# EAGLE schematic obc (EAGLE 9.4.2)

## Sheet 1 of 6: MCU
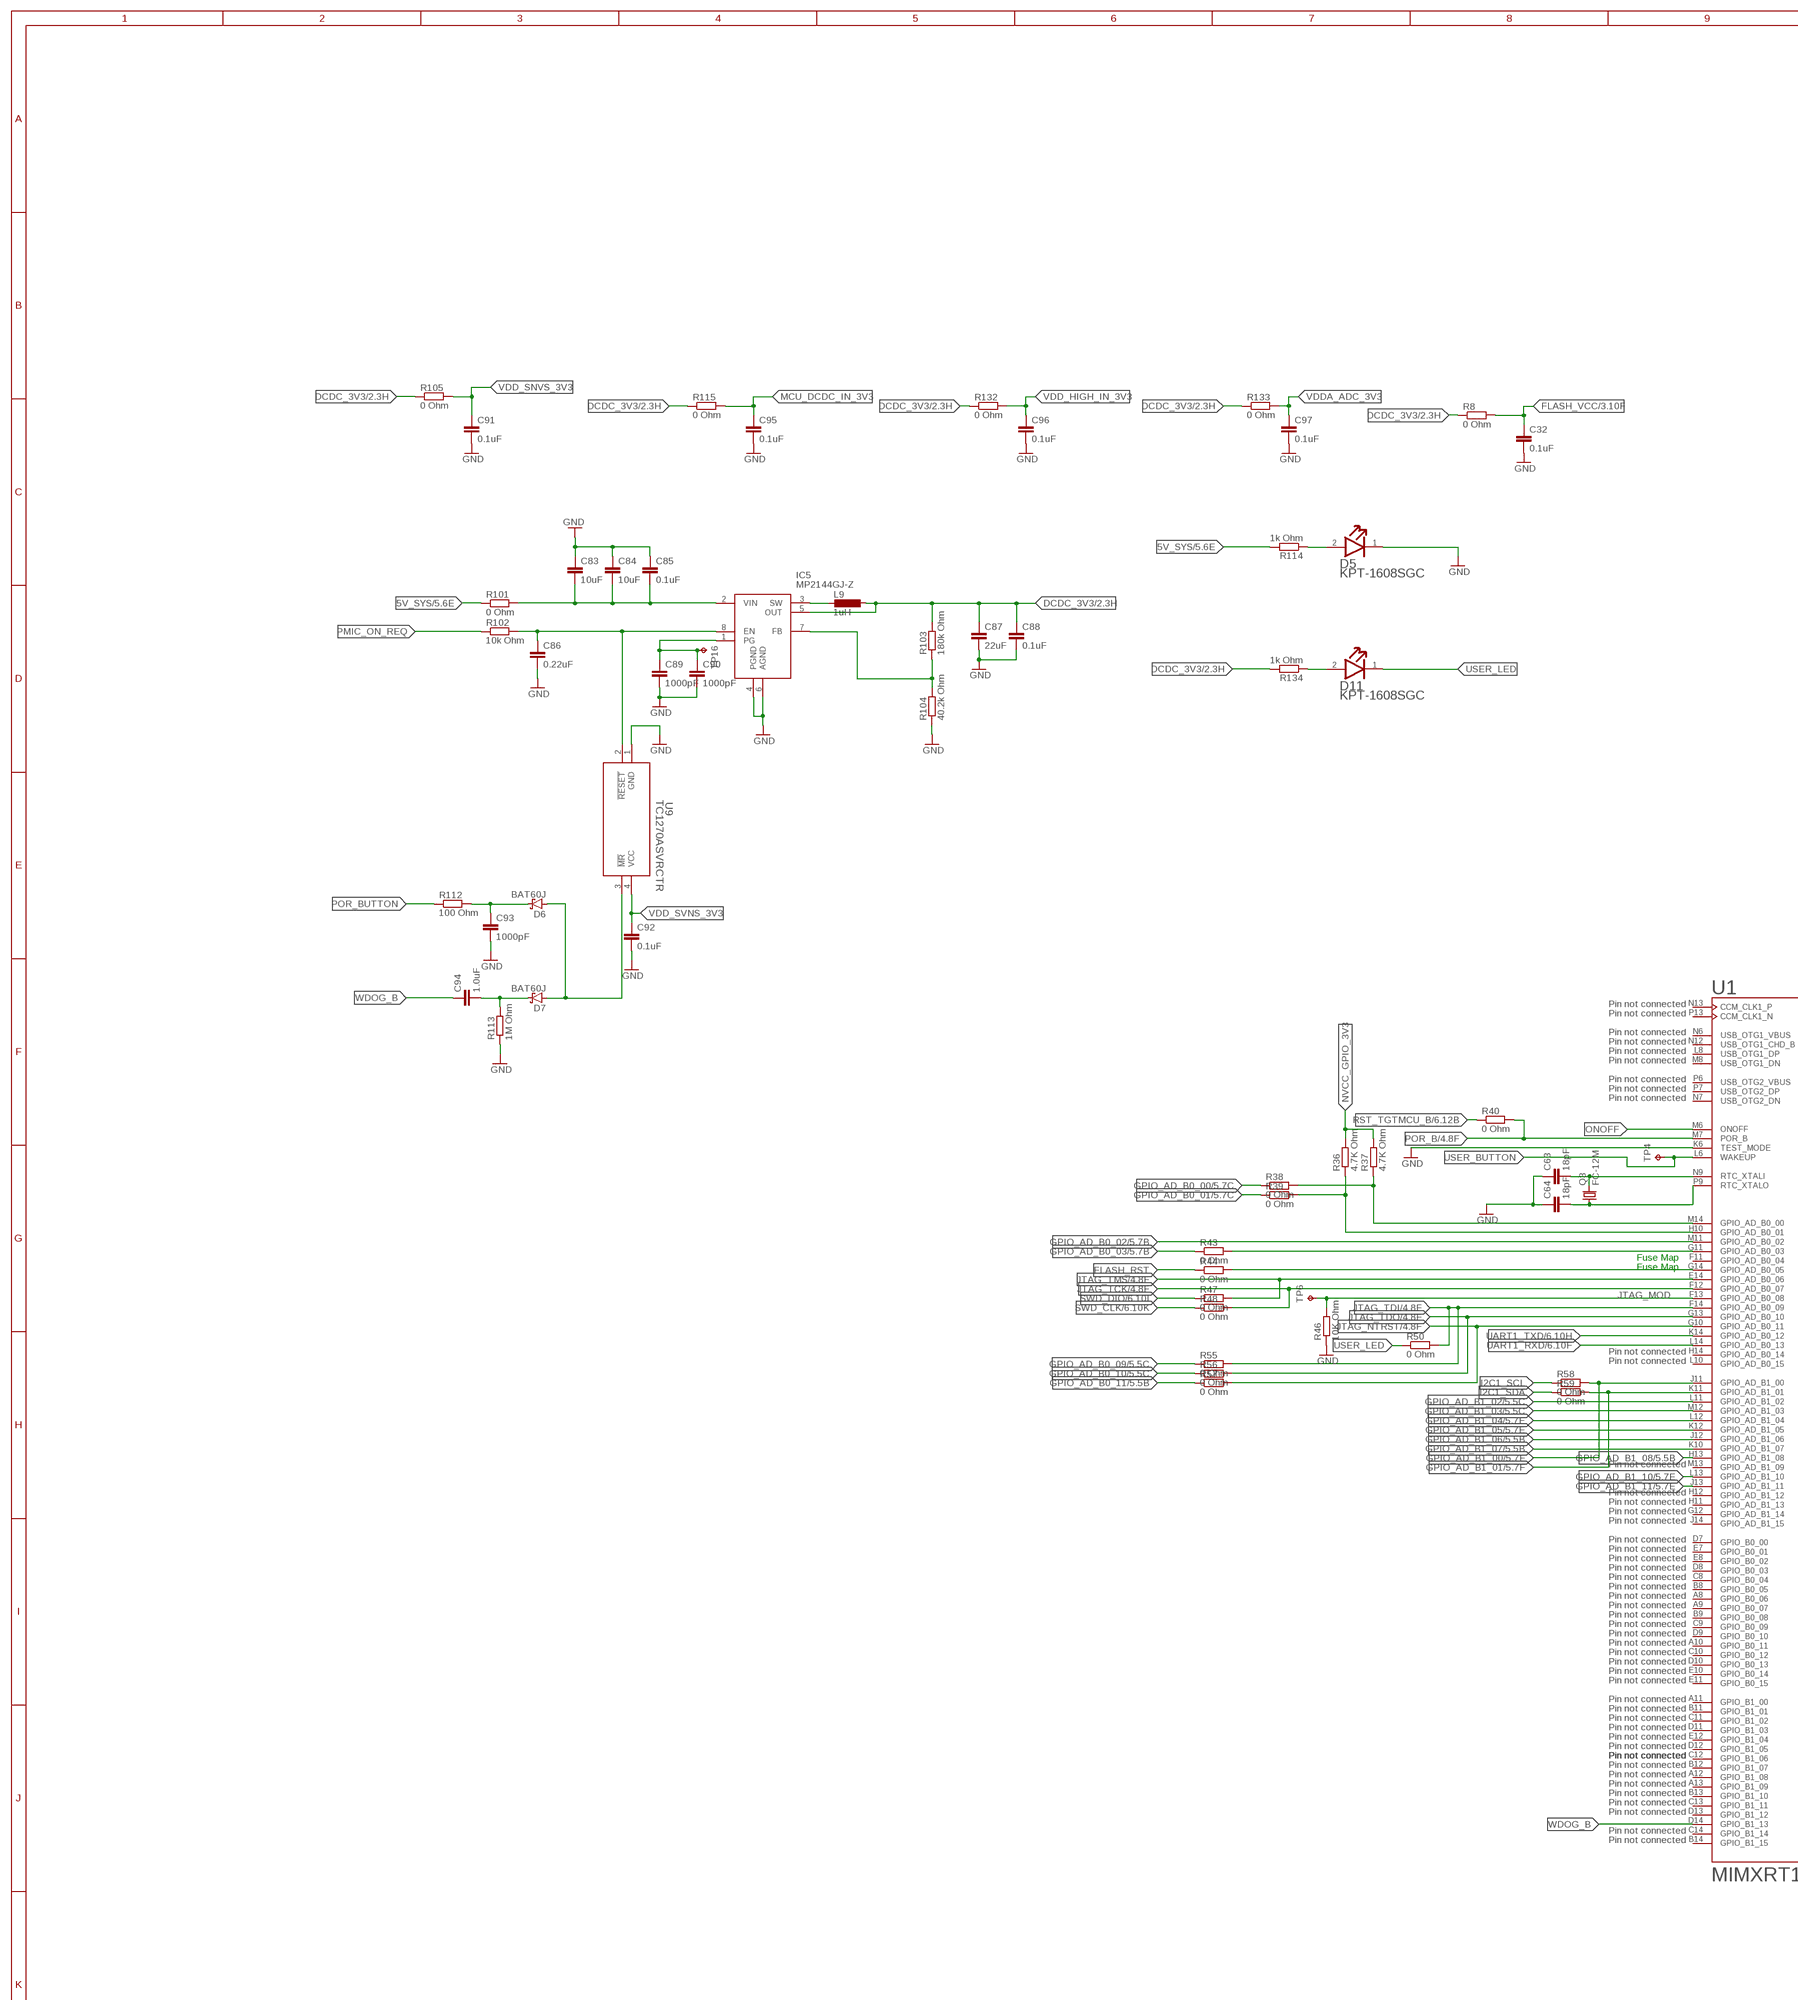
[diagram p0: schematic, sheet 1, part 1 of 3]
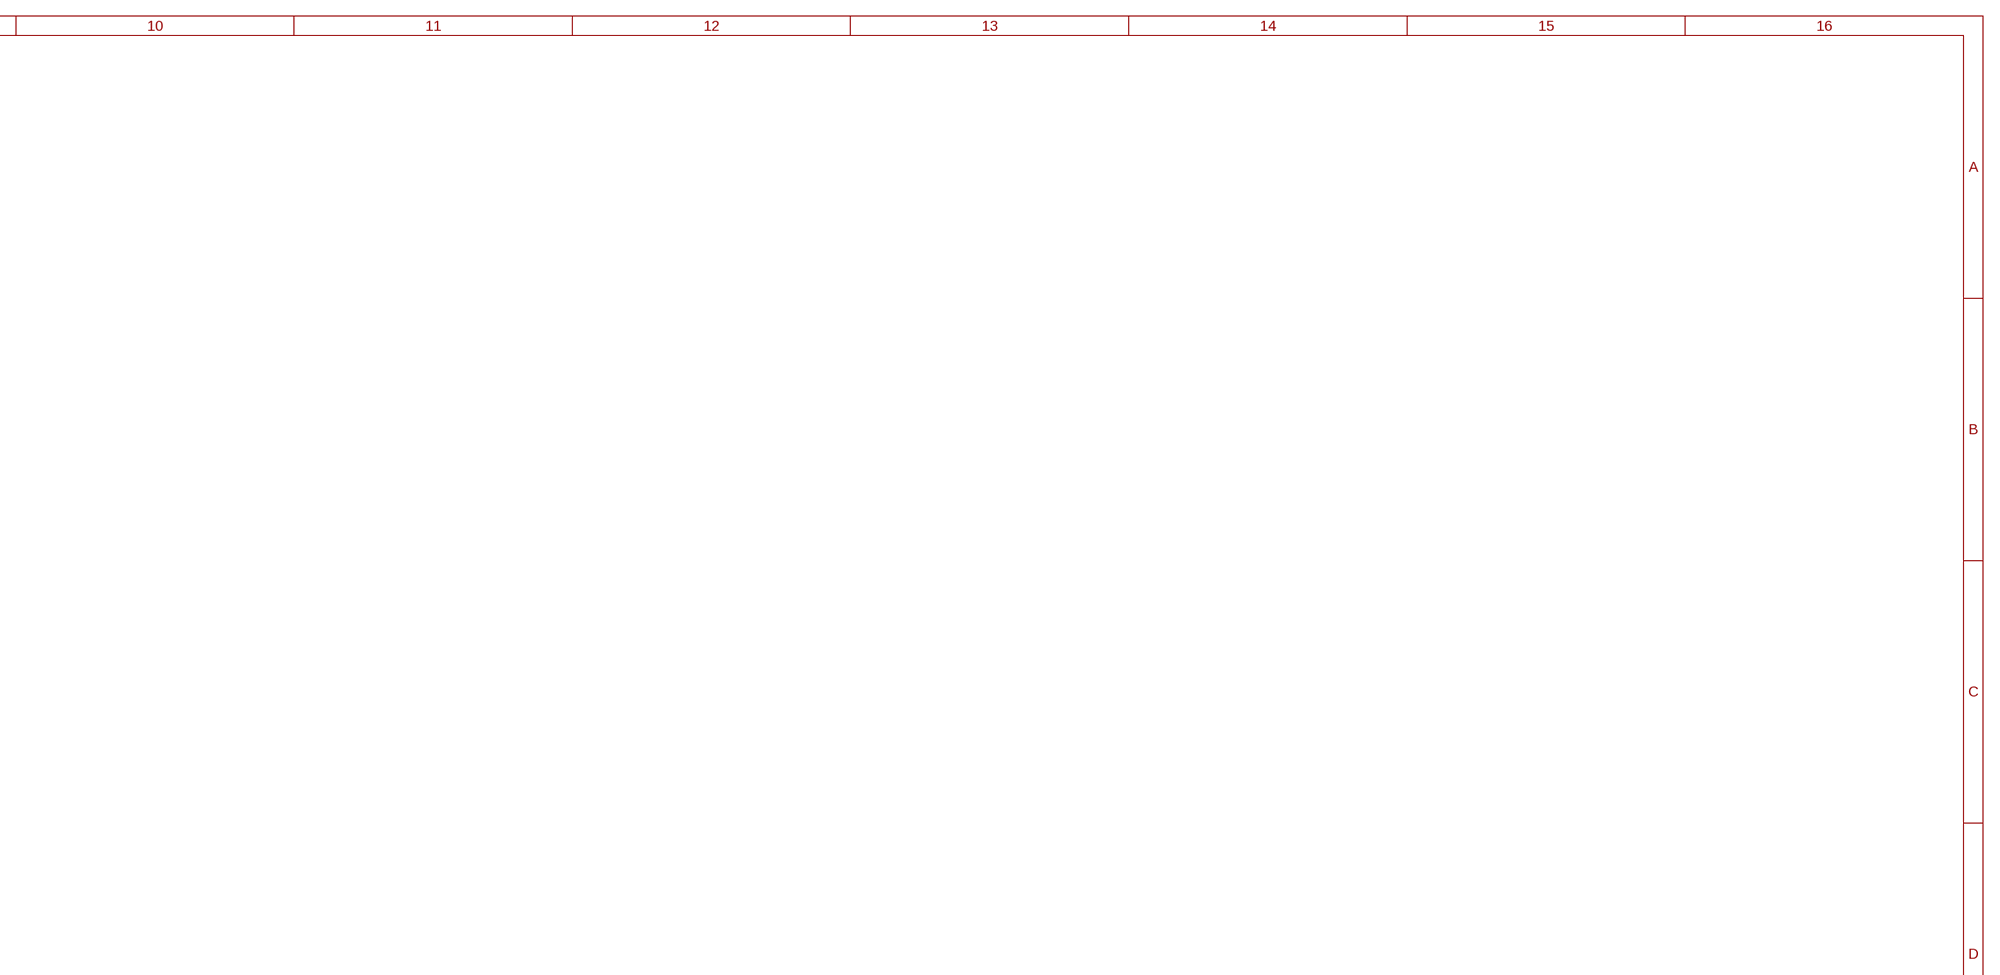
[diagram p1: schematic, sheet 1, part 2 of 3]
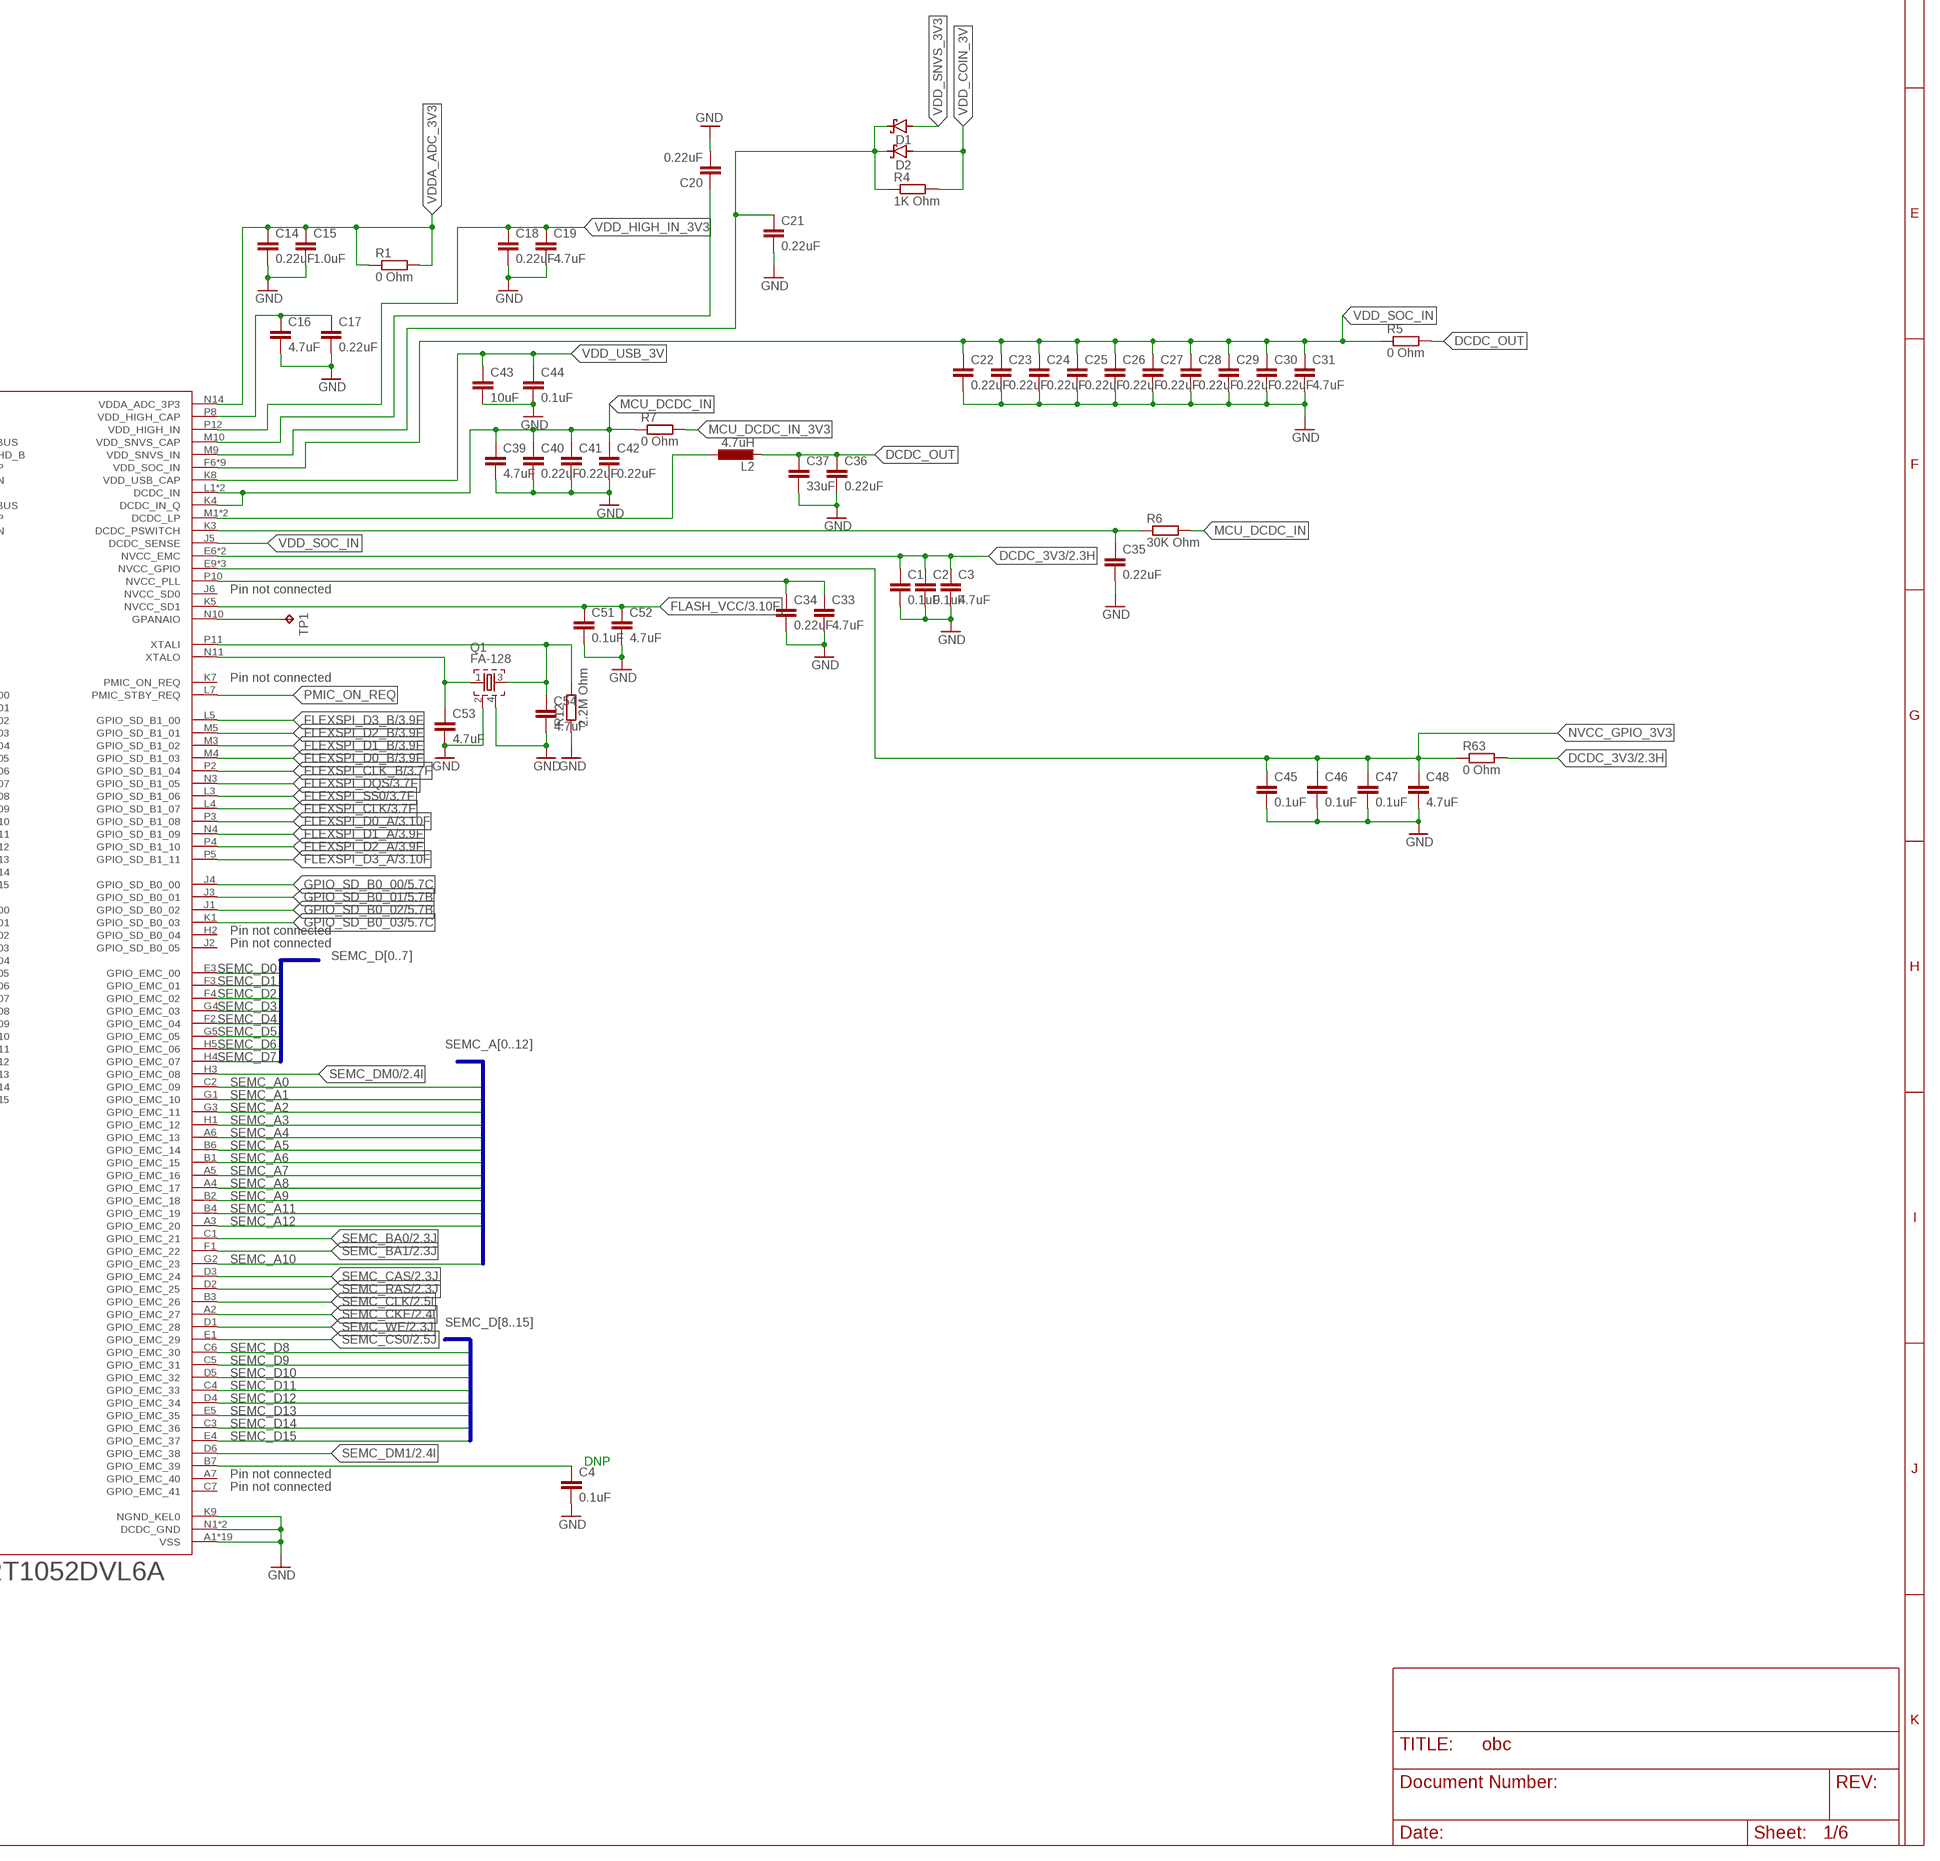
[diagram p2: schematic, sheet 1, part 3 of 3]

### Parts
C1  0.1uF  C-EUC0402K  [C0402K]
C2  0.1uF  C-EUC0402K  [C0402K]
C3  4.7uF  C-EUC0402K  [C0402K]
C4  0.1uF  C-EUC0402K  [C0402K]
C14  0.22uF  C-EUC0402K  [C0402K]
C15  1.0uF  C-EUC0402K  [C0402K]
C16  4.7uF  C-EUC0402K  [C0402K]
C17  0.22uF  C-EUC0402K  [C0402K]
C18  0.22uF  C-EUC0402K  [C0402K]
C19  4.7uF  C-EUC0402K  [C0402K]
C20  0.22uF  C-EUC0402K  [C0402K]
C21  0.22uF  C-EUC0402K  [C0402K]
C22  0.22uF  C-EUC0402K  [C0402K]
C23  0.22uF  C-EUC0402K  [C0402K]
C24  0.22uF  C-EUC0402K  [C0402K]
C25  0.22uF  C-EUC0402K  [C0402K]
C26  0.22uF  C-EUC0402K  [C0402K]
C27  0.22uF  C-EUC0402K  [C0402K]
C28  0.22uF  C-EUC0402K  [C0402K]
C29  0.22uF  C-EUC0402K  [C0402K]
C30  0.22uF  C-EUC0402K  [C0402K]
C31  4.7uF  C-EUC0402K  [C0402K]
C32  0.1uF  C-EUC0402K  [C0402K]
C33  4.7uF  C-EUC0402K  [C0402K]
C34  0.22uF  C-EUC0402K  [C0402K]
C35  0.22uF  C-EUC0402K  [C0402K]
C36  0.22uF  C-EUC0402K  [C0402K]
C37  33uF  C-EUC0402K  [C0402K]
C39  4.7uF  C-EUC0402K  [C0402K]
C40  0.22uF  C-EUC0402K  [C0402K]
C41  0.22uF  C-EUC0402K  [C0402K]
C42  0.22uF  C-EUC0402K  [C0402K]
C43  10uF  C-EUC0402K  [C0402K]
C44  0.1uF  C-EUC0402K  [C0402K]
C45  0.1uF  C-EUC0402K  [C0402K]
C46  0.1uF  C-EUC0402K  [C0402K]
C47  0.1uF  C-EUC0402K  [C0402K]
C48  4.7uF  C-EUC0402K  [C0402K]
C51  0.1uF  C-EUC0402K  [C0402K]
C52  4.7uF  C-EUC0402K  [C0402K]
C53  4.7uF  C-EUC0402K  [C0402K]
C54  4.7uF  C-EUC0402K  [C0402K]
C63  18pF  C-EUC0402K  [C0402K]
C64  18pF  C-EUC0402K  [C0402K]
C83  10uF  C-EUC0402K  [C0402K]
C84  10uF  C-EUC0402K  [C0402K]
C85  0.1uF  C-EUC0402K  [C0402K]
C86  0.22uF  C-EUC0402K  [C0402K]
C87  22uF  C-EUC0402K  [C0402K]
C88  0.1uF  C-EUC0402K  [C0402K]
C89  1000pF  C-EUC0402K  [C0402K]
C90  1000pF  C-EUC0402K  [C0402K]
C91  0.1uF  C-EUC0402K  [C0402K]
C92  0.1uF  C-EUC0402K  [C0402K]
C93  1000pF  C-EUC0402K  [C0402K]
C94  1.0uF  C-EUC0402K  [C0402K]
C95  0.1uF  C-EUC0402K  [C0402K]
C96  0.1uF  C-EUC0402K  [C0402K]
C97  0.1uF  C-EUC0402K  [C0402K]
D1  SCHOTTKY-DIODESMC  [SMC]
D2  SCHOTTKY-DIODESMC  [SMC]
D5  KINGBRIGHT_KPT-1608SGCKINGBRIGHT_KPT-1608SGC_0_0  [KINGBRIGHT_KPT-1608SGC_0]
D6  BAT60J  [SOD323_ST]
D7  BAT60J  [SOD323_ST]
D11  KINGBRIGHT_KPT-1608SGCKINGBRIGHT_KPT-1608SGC_0_0  [KINGBRIGHT_KPT-1608SGC_0]
IC5  MP2144GJ-Z  [SOT65P280X100-8N]
L2  4.7uH  L-EUL4035M  [L4035M]
L9  1uH  L-EU0204V  [0204V]
Q1  FA-128  [FA-128]
Q3  FC-12M  [FC-12M]
R1  0 Ohm  R-EU_R0402  [R0402]
R4  1K Ohm  R-EU_R0402  [R0402]
R5  0 Ohm  R-EU_R0402  [R0402]
R6  30K Ohm  R-EU_R0402  [R0402]
R7  0 Ohm  R-EU_R0402  [R0402]
R8  0 Ohm  R-EU_R0402  [R0402]
R12  2.2M Ohm  R-EU_R0402  [R0402]
R36  4.7K Ohm  R-EU_R0402  [R0402]
R37  4.7K Ohm  R-EU_R0402  [R0402]
R38  0 Ohm  R-EU_R0402  [R0402]
R39  0 Ohm  R-EU_R0402  [R0402]
R40  0 Ohm  R-EU_R0402  [R0402]
R43  0 Ohm  R-EU_R0402  [R0402]
R44  0 Ohm  R-EU_R0402  [R0402]
R46  10K Ohm  R-EU_R0402  [R0402]
R47  0 Ohm  R-EU_R0402  [R0402]
R48  0 Ohm  R-EU_R0402  [R0402]
R50  0 Ohm  R-EU_R0402  [R0402]
R55  0 Ohm  R-EU_R0402  [R0402]
R56  0 Ohm  R-EU_R0402  [R0402]
R57  0 Ohm  R-EU_R0402  [R0402]
R58  0 Ohm  R-EU_R0402  [R0402]
R59  0 Ohm  R-EU_R0402  [R0402]
R63  0 Ohm  R-EU_R0402  [R0402]
R101  0 Ohm  R-EU_R0402  [R0402]
R102  10k Ohm  R-EU_R0402  [R0402]
R103  180k Ohm  R-EU_R0402  [R0402]
R104  40.2k Ohm  R-EU_R0402  [R0402]
R105  0 Ohm  R-EU_R0402  [R0402]
R112  100 Ohm  R-EU_R0402  [R0402]
R113  1M Ohm  R-EU_R0402  [R0402]
R114  1k Ohm  R-EU_R0402  [R0402]
R115  0 Ohm  R-EU_R0402  [R0402]
R132  0 Ohm  R-EU_R0402  [R0402]
R133  0 Ohm  R-EU_R0402  [R0402]
R134  1k Ohm  R-EU_R0402  [R0402]
TP1  TPTP06R  [TP06R]
TP4  TPTP06R  [TP06R]
TP6  TPTP06R  [TP06R]
TP16  TPTP06R  [TP06R]
U1  MIMXRT1052DVL6A  [BGA196C65P14X14_1000X1000X152N]
U9  TC1270ASVRCTR  [SOT-143_MC]

### Nets
5V_SYS: R101.1 R114.2 ; also sheet 5
CAN_STBY: R44.2 U1.G14(GPIO_AD_B0_05)
DCDC_3V3: C1.1 C2.1 C3.1 C87.1 C88.1 IC5.5(OUT) L9.1 R8.1 R63.2 R103.2 R105.1 R115.1 R132.1 R133.1 R134.2 U1.E6(NVCC_EMC) U1.F5(NVCC_EMC) ; also sheet 2,4
DCDC_OUT: C36.1 C37.1 L2.2 R5.2
FLASH_RST: R44.1
FLASH_VCC: C32.1 C51.1 C52.1 R8.2 U1.K5(NVCC_SD1) ; also sheet 3
FLEXSPI_CLK: U1.L4(GPIO_SD_B1_07) ; also sheet 3
FLEXSPI_CLK_B: U1.P2(GPIO_SD_B1_04) ; also sheet 3
FLEXSPI_D0_A: U1.P3(GPIO_SD_B1_08) ; also sheet 3
FLEXSPI_D0_B: U1.M4(GPIO_SD_B1_03) ; also sheet 3
FLEXSPI_D1_A: U1.N4(GPIO_SD_B1_09) ; also sheet 3
FLEXSPI_D1_B: U1.M3(GPIO_SD_B1_02) ; also sheet 3
FLEXSPI_D2_A: U1.P4(GPIO_SD_B1_10) ; also sheet 3
FLEXSPI_D2_B: U1.M5(GPIO_SD_B1_01) ; also sheet 3
FLEXSPI_D3_A: U1.P5(GPIO_SD_B1_11) ; also sheet 3
FLEXSPI_D3_B: U1.L5(GPIO_SD_B1_00) ; also sheet 3
FLEXSPI_DQS: U1.N3(GPIO_SD_B1_05) ; also sheet 3
FLEXSPI_SS0: U1.L3(GPIO_SD_B1_06) ; also sheet 3
GND: C1.2 C2.2 C3.2 C4.2 C14.2 C15.2 C16.2 C17.2 C18.2 C19.2 C20.2 C21.2 C22.2 C23.2 C24.2 C25.2 C26.2 C27.2 C28.2 C29.2 C30.2 C31.2 C32.2 C33.2 C34.2 C35.2 C36.2 C37.2 C39.2 C40.2 C41.2 C42.2 C43.2 C44.2 C45.2 C46.2 C47.2 C48.2 C51.2 C52.2 C53.2 C54.2 C63.1 C64.1 C83.1 C84.1 C85.1 C86.2 C87.2 C88.2 C89.2 C90.2 C91.2 C92.2 C93.2 C95.2 C96.2 C97.2 D5.1(CATHODE) IC5.4(PGND) IC5.6(AGND) Q1.2 Q1.4 R12.1 R46.1 R104.1 R113.1 U1.A1(VSS) U1.A14(VSS) U1.B5(VSS) U1.B10(VSS) U1.E2(VSS) U1.E13(VSS) U1.G7(VSS) U1.G8(VSS) U1.H7(VSS) U1.H8(VSS) U1.J7(VSS) U1.J8(VSS) U1.K2(VSS) U1.K6(TEST_MODE) U1.K9(NGND_KEL0) U1.K13(VSS) U1.L9(VSS) U1.N1(DCDC_GND) U1.N2(DCDC_GND) U1.N5(VSS) U1.N8(VSS) U1.P1(VSS) U1.P14(VSS) U9.1(GND) ; also sheet 2,3,4,6
GPIO_AD_B0_00: R38.1 ; also sheet 5
GPIO_AD_B0_01: R39.1 ; also sheet 5
GPIO_AD_B0_02: U1.M11(GPIO_AD_B0_02) ; also sheet 5
GPIO_AD_B0_03: R43.1 ; also sheet 5
GPIO_AD_B0_09: R55.1 ; also sheet 5
GPIO_AD_B0_10: R56.1 ; also sheet 5
GPIO_AD_B0_11: R57.1 ; also sheet 5
GPIO_AD_B1_00: R58.2 U1.J11(GPIO_AD_B1_00) ; also sheet 5
GPIO_AD_B1_01: R59.2 U1.K11(GPIO_AD_B1_01) ; also sheet 5
GPIO_AD_B1_02: U1.L11(GPIO_AD_B1_02) ; also sheet 5
GPIO_AD_B1_03: U1.M12(GPIO_AD_B1_03) ; also sheet 5
GPIO_AD_B1_04: U1.L12(GPIO_AD_B1_04) ; also sheet 5
GPIO_AD_B1_05: U1.K12(GPIO_AD_B1_05) ; also sheet 5
GPIO_AD_B1_06: U1.J12(GPIO_AD_B1_06) ; also sheet 5
GPIO_AD_B1_07: U1.K10(GPIO_AD_B1_07) ; also sheet 5
GPIO_AD_B1_08: U1.H13(GPIO_AD_B1_08) ; also sheet 5
GPIO_AD_B1_10: U1.L13(GPIO_AD_B1_10) ; also sheet 5
GPIO_AD_B1_11: U1.J13(GPIO_AD_B1_11) ; also sheet 5
GPIO_SD_B0_00: U1.J4(GPIO_SD_B0_00) ; also sheet 5
GPIO_SD_B0_01: U1.J3(GPIO_SD_B0_01) ; also sheet 5
GPIO_SD_B0_02: U1.J1(GPIO_SD_B0_02) ; also sheet 5
GPIO_SD_B0_03: U1.K1(GPIO_SD_B0_03) ; also sheet 5
I2C1_SCL: R58.1
I2C1_SDA: R59.1
JTAG_MOD: R46.2 TP6.TP U1.F13(GPIO_AD_B0_08)
JTAG_NTRST: R57.2 U1.G10(GPIO_AD_B0_11) ; also sheet 4
JTAG_TCK: R48.2 U1.F12(GPIO_AD_B0_07) ; also sheet 4
JTAG_TDI: R50.2 R55.2 U1.F14(GPIO_AD_B0_09) ; also sheet 4
JTAG_TDO: R56.2 U1.G13(GPIO_AD_B0_10) ; also sheet 4
JTAG_TMS: R47.2 U1.E14(GPIO_AD_B0_06) ; also sheet 4
MCU_DCDC_IN: C39.1 C40.1 C41.1 C42.1 R6.2 R7.1 U1.K4(DCDC_IN_Q) U1.L1(DCDC_IN) U1.L2(DCDC_IN)
MCU_DCDC_IN_3V3: C95.1 R7.2 R115.2
N$1: C4.1 U1.B7(GPIO_EMC_39)
N$2: C16.1 C17.1 U1.P8(VDD_HIGH_CAP)
N$3: C20.1 U1.M10(VDD_SNVS_CAP)
N$4: C35.1 R6.1 U1.K3(DCDC_PSWITCH)
N$5: C21.1 D1.C D2.C R4.1 U1.M9(VDD_SNVS_IN)
N$6: L2.1 U1.M1(DCDC_LP) U1.M2(DCDC_LP)
N$7: C33.1 C34.1 U1.P10(NVCC_PLL)
N$9: TP1.TP U1.N10(GPANAIO)
N$10: C54.1 Q1.3 R12.2 U1.P11(XTALI)
N$11: C53.1 Q1.1 U1.N11(XTALO)
N$53: C63.2 Q3.2 U1.N9(RTC_XTALI)
N$55: C64.2 Q3.1 U1.P9(RTC_XTALO)
N$61: C83.2 C84.2 C85.2 IC5.2(VIN) R101.2
N$62: C86.1 IC5.8(EN) R102.2 U9.2(!RESET)
N$63: C89.1 C90.1 IC5.1(PG) TP16.TP
N$64: IC5.3(SW) L9.2
N$67: IC5.7(FB) R103.1 R104.2
N$68: D6.A D7.A U9.3(!MR)
N$71: C93.1 D6.C R112.2
N$74: C94.2 D7.C R113.2
N$75: D5.2(ANODE) R114.1
N$76: D11.2(ANODE) R134.1
NVCC_GPIO_3V3: C45.1 C46.1 C47.1 C48.1 R36.2 R37.2 R63.1 U1.E9(NVCC_GPIO) U1.F10(NVCC_GPIO) U1.J10(NVCC_GPIO)
ONOFF: U1.M6(ONOFF)
PMIC_ON_REQ: R102.1 U1.L7(PMIC_STBY_REQ)
POR_B: R40.2 U1.M7(POR_B) ; also sheet 4
POR_BUTTON: R112.1
RST_TGTMCU_B: R40.1 ; also sheet 6
SEMC_A0: U1.C2(GPIO_EMC_09) ; also sheet 2
SEMC_A1: U1.G1(GPIO_EMC_10) ; also sheet 2
SEMC_A2: U1.G3(GPIO_EMC_11) ; also sheet 2
SEMC_A3: U1.H1(GPIO_EMC_12) ; also sheet 2
SEMC_A4: U1.A6(GPIO_EMC_13) ; also sheet 2
SEMC_A5: U1.B6(GPIO_EMC_14) ; also sheet 2
SEMC_A6: U1.B1(GPIO_EMC_15) ; also sheet 2
SEMC_A7: U1.A5(GPIO_EMC_16) ; also sheet 2
SEMC_A8: U1.A4(GPIO_EMC_17) ; also sheet 2
SEMC_A9: U1.B2(GPIO_EMC_18) ; also sheet 2
SEMC_A10: U1.G2(GPIO_EMC_23) ; also sheet 2
SEMC_A11: U1.B4(GPIO_EMC_19) ; also sheet 2
SEMC_A12: U1.A3(GPIO_EMC_20) ; also sheet 2
SEMC_BA0: U1.C1(GPIO_EMC_21) ; also sheet 2
SEMC_BA1: U1.F1(GPIO_EMC_22) ; also sheet 2
SEMC_CAS: U1.D3(GPIO_EMC_24) ; also sheet 2
SEMC_CKE: U1.A2(GPIO_EMC_27) ; also sheet 2
SEMC_CLK: U1.B3(GPIO_EMC_26) ; also sheet 2
SEMC_CS0: U1.E1(GPIO_EMC_29) ; also sheet 2
SEMC_D0: U1.E3(GPIO_EMC_00) ; also sheet 2
SEMC_D1: U1.F3(GPIO_EMC_01) ; also sheet 2
SEMC_D2: U1.F4(GPIO_EMC_02) ; also sheet 2
SEMC_D3: U1.G4(GPIO_EMC_03) ; also sheet 2
SEMC_D4: U1.F2(GPIO_EMC_04) ; also sheet 2
SEMC_D5: U1.G5(GPIO_EMC_05) ; also sheet 2
SEMC_D6: U1.H5(GPIO_EMC_06) ; also sheet 2
SEMC_D7: U1.H4(GPIO_EMC_07) ; also sheet 2
SEMC_D8: U1.C6(GPIO_EMC_30) ; also sheet 2
SEMC_D9: U1.C5(GPIO_EMC_31) ; also sheet 2
SEMC_D10: U1.D5(GPIO_EMC_32) ; also sheet 2
SEMC_D11: U1.C4(GPIO_EMC_33) ; also sheet 2
SEMC_D12: U1.D4(GPIO_EMC_34) ; also sheet 2
SEMC_D13: U1.E5(GPIO_EMC_35) ; also sheet 2
SEMC_D14: U1.C3(GPIO_EMC_36) ; also sheet 2
SEMC_D15: U1.E4(GPIO_EMC_37) ; also sheet 2
SEMC_DM0: U1.H3(GPIO_EMC_08) ; also sheet 2
SEMC_DM1: U1.D6(GPIO_EMC_38) ; also sheet 2
SEMC_RAS: U1.D2(GPIO_EMC_25) ; also sheet 2
SEMC_WE: U1.D1(GPIO_EMC_28) ; also sheet 2
SWD_CLK: R48.1 ; also sheet 6
SWD_DIO: R47.1 ; also sheet 6
UART1_RXD: U1.L14(GPIO_AD_B0_13) ; also sheet 6
UART1_TXD: U1.K14(GPIO_AD_B0_12) ; also sheet 6
USB_HOST_OC: R37.1 R38.2 U1.M14(GPIO_AD_B0_00)
USB_OTG1_ID: R36.1 R39.2 U1.H10(GPIO_AD_B0_01)
USB_OTG1_OC: R43.2 U1.G11(GPIO_AD_B0_03)
USER_BUTTON: TP4.TP U1.L6(WAKEUP)
USER_LED: D11.1(CATHODE) R50.1
VDD_COIN_3V: D2.A R4.2
VDD_HIGH_IN_3V3: C18.1 C19.1 C96.1 R132.2 U1.P12(VDD_HIGH_IN)
VDD_SNVS_3V3: C91.1 D1.A R105.2
VDD_SOC_IN: C22.1 C23.1 C24.1 C25.1 C26.1 C27.1 C28.1 C29.1 C30.1 C31.1 R5.1 U1.F6(VDD_SOC_IN) U1.F7(VDD_SOC_IN) U1.F8(VDD_SOC_IN) U1.F9(VDD_SOC_IN) U1.G6(VDD_SOC_IN) U1.G9(VDD_SOC_IN) U1.H6(VDD_SOC_IN) U1.H9(VDD_SOC_IN) U1.J5(DCDC_SENSE) U1.J9(VDD_SOC_IN)
VDD_SVNS_3V3: C92.1 U9.4(VCC)
VDD_USB_3V: C43.1 C44.1 U1.K8(VDD_USB_CAP)
VDDA_ADC_3V3: C14.1 C15.1 C97.1 R1.1 R1.2 R133.2 U1.N14(VDDA_ADC_3P3)
WDOG_B: C94.1 U1.D14(GPIO_B1_13)
Unconnected: U1.A7(GPIO_EMC_40) U1.A8(GPIO_B0_06) U1.A9(GPIO_B0_07) U1.A10(GPIO_B0_11) U1.A11(GPIO_B1_00) U1.A12(GPIO_B1_08) U1.A13(GPIO_B1_09) U1.B8(GPIO_B0_05) U1.B9(GPIO_B0_08) U1.B11(GPIO_B1_01) U1.B12(GPIO_B1_07) U1.B13(GPIO_B1_10) U1.B14(GPIO_B1_15) U1.C7(GPIO_EMC_41) U1.C8(GPIO_B0_04) U1.C9(GPIO_B0_09) U1.C10(GPIO_B0_12) U1.C11(GPIO_B1_02) U1.C12(GPIO_B1_06) U1.C13(GPIO_B1_11) U1.C14(GPIO_B1_14) U1.D7(GPIO_B0_00) U1.D8(GPIO_B0_03) U1.D9(GPIO_B0_10) U1.D10(GPIO_B0_13) U1.D11(GPIO_B1_03) U1.D12(GPIO_B1_05) U1.D13(GPIO_B1_12) U1.E7(GPIO_B0_01) U1.E8(GPIO_B0_02) U1.E10(GPIO_B0_14) U1.E11(GPIO_B0_15) U1.E12(GPIO_B1_04) U1.F11(GPIO_AD_B0_04) U1.G12(GPIO_AD_B1_14) U1.H2(GPIO_SD_B0_04) U1.H11(GPIO_AD_B1_13) U1.H12(GPIO_AD_B1_12) U1.H14(GPIO_AD_B0_14) U1.J2(GPIO_SD_B0_05) U1.J14(GPIO_AD_B1_15) U1.K7(PMIC_ON_REQ) U1.L8(USB_OTG1_DP) U1.L10(GPIO_AD_B0_15) U1.M8(USB_OTG1_DN) U1.M13(GPIO_AD_B1_09) U1.N6(USB_OTG1_VBUS) U1.N7(USB_OTG2_DN) U1.N12(USB_OTG1_CHD_B) U1.N13(CCM_CLK1_P) U1.P6(USB_OTG2_VBUS) U1.P7(USB_OTG2_DP) U1.P13(CCM_CLK1_N)

### Buses
SEMC_D[0..7]
SEMC_A[0..12]
SEMC_D[8..15]

### Notes on the sheet
- Pin not connected
- Pin not connected
- Pin not connected
- Pin not connected
- Pin not connected
- Pin not connected
- Pin not connected
- Pin not connected
- Pin not connected
- Pin not connected
- Pin not connected
- Fuse Map
- Fuse Map
- Pin not connected
- Pin not connected
- Pin not connected
- Pin not connected
- Pin not connected
- Pin not connected
- Pin not connected
- Pin not connected
- Pin not connected
- Pin not connected
- Pin not connected
- Pin not connected
- Pin not connected
- Pin not connected
- Pin not connected
- Pin not connected
- Pin not connected
- Pin not connected
- Pin not connected
- Pin not connected
- Pin not connected
- Pin not connected
- Pin not connected
- Pin not connected
- Pin not connected
- Pin not connected
- Pin not connected
- Pin not connected
- Pin not connected
- Pin not connected
- Pin not connected
- Pin not connected | Pin not connected | Pin not connected
- Pin not connected
- Pin not connected
- Pin not connected
- Pin not connected | DNP
- Pin not connected | Pin not connected
- Pin not connected | Pin not connected
- Pin not connected
- Pin not connected

## Sheet 2 of 6: SDRAM
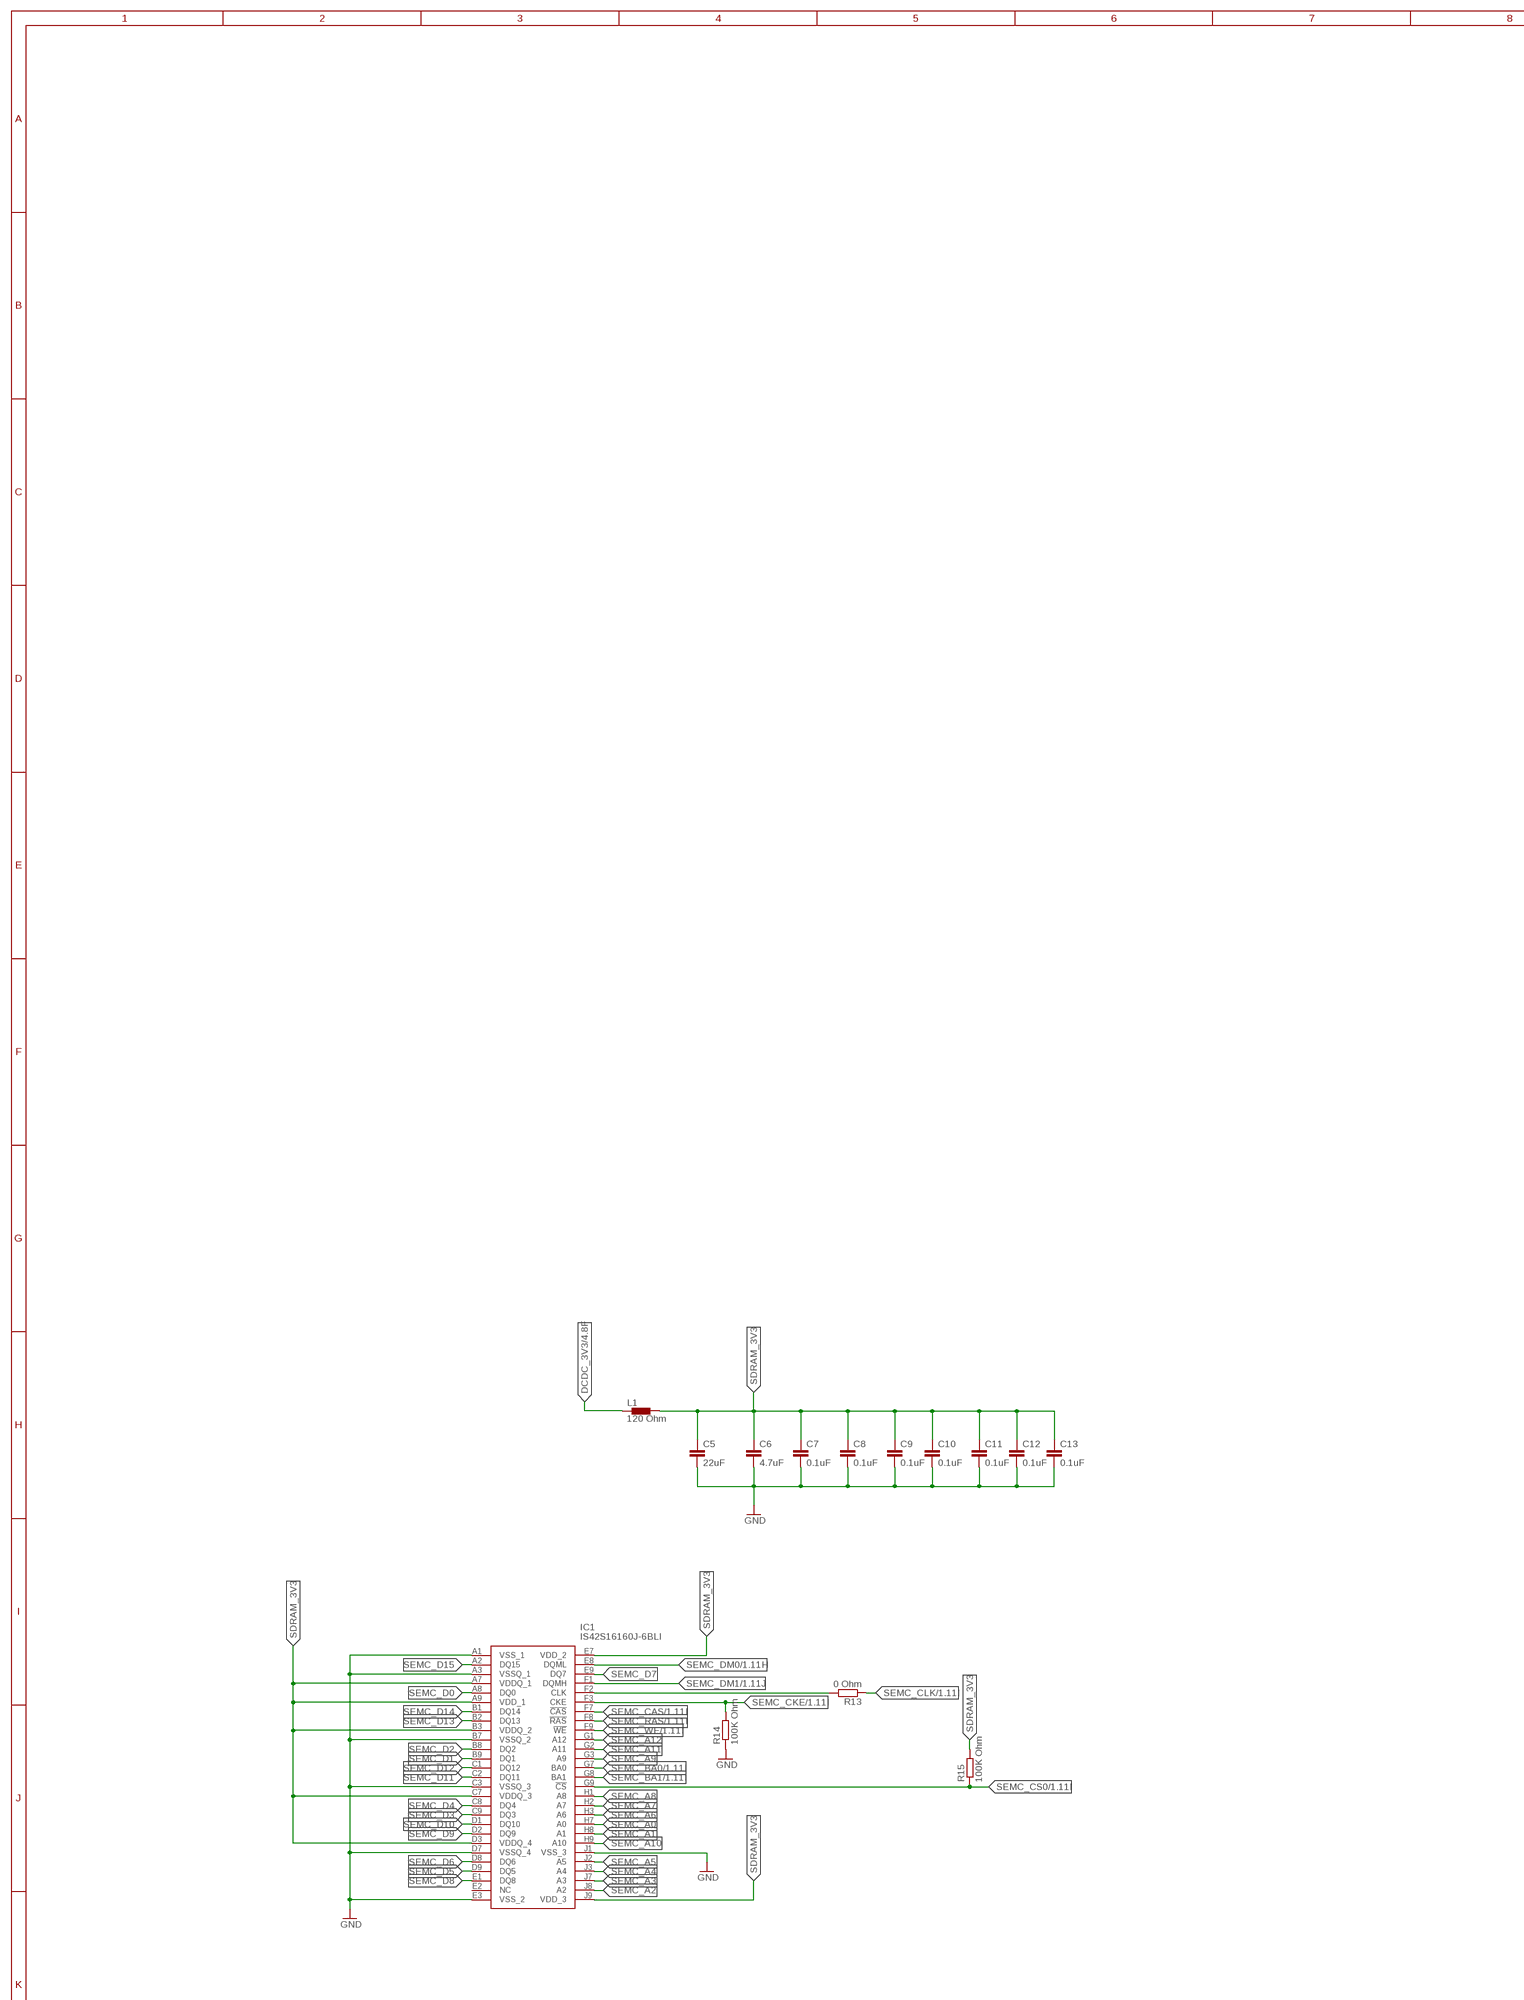
[diagram p3: schematic, sheet 2, part 1 of 3]
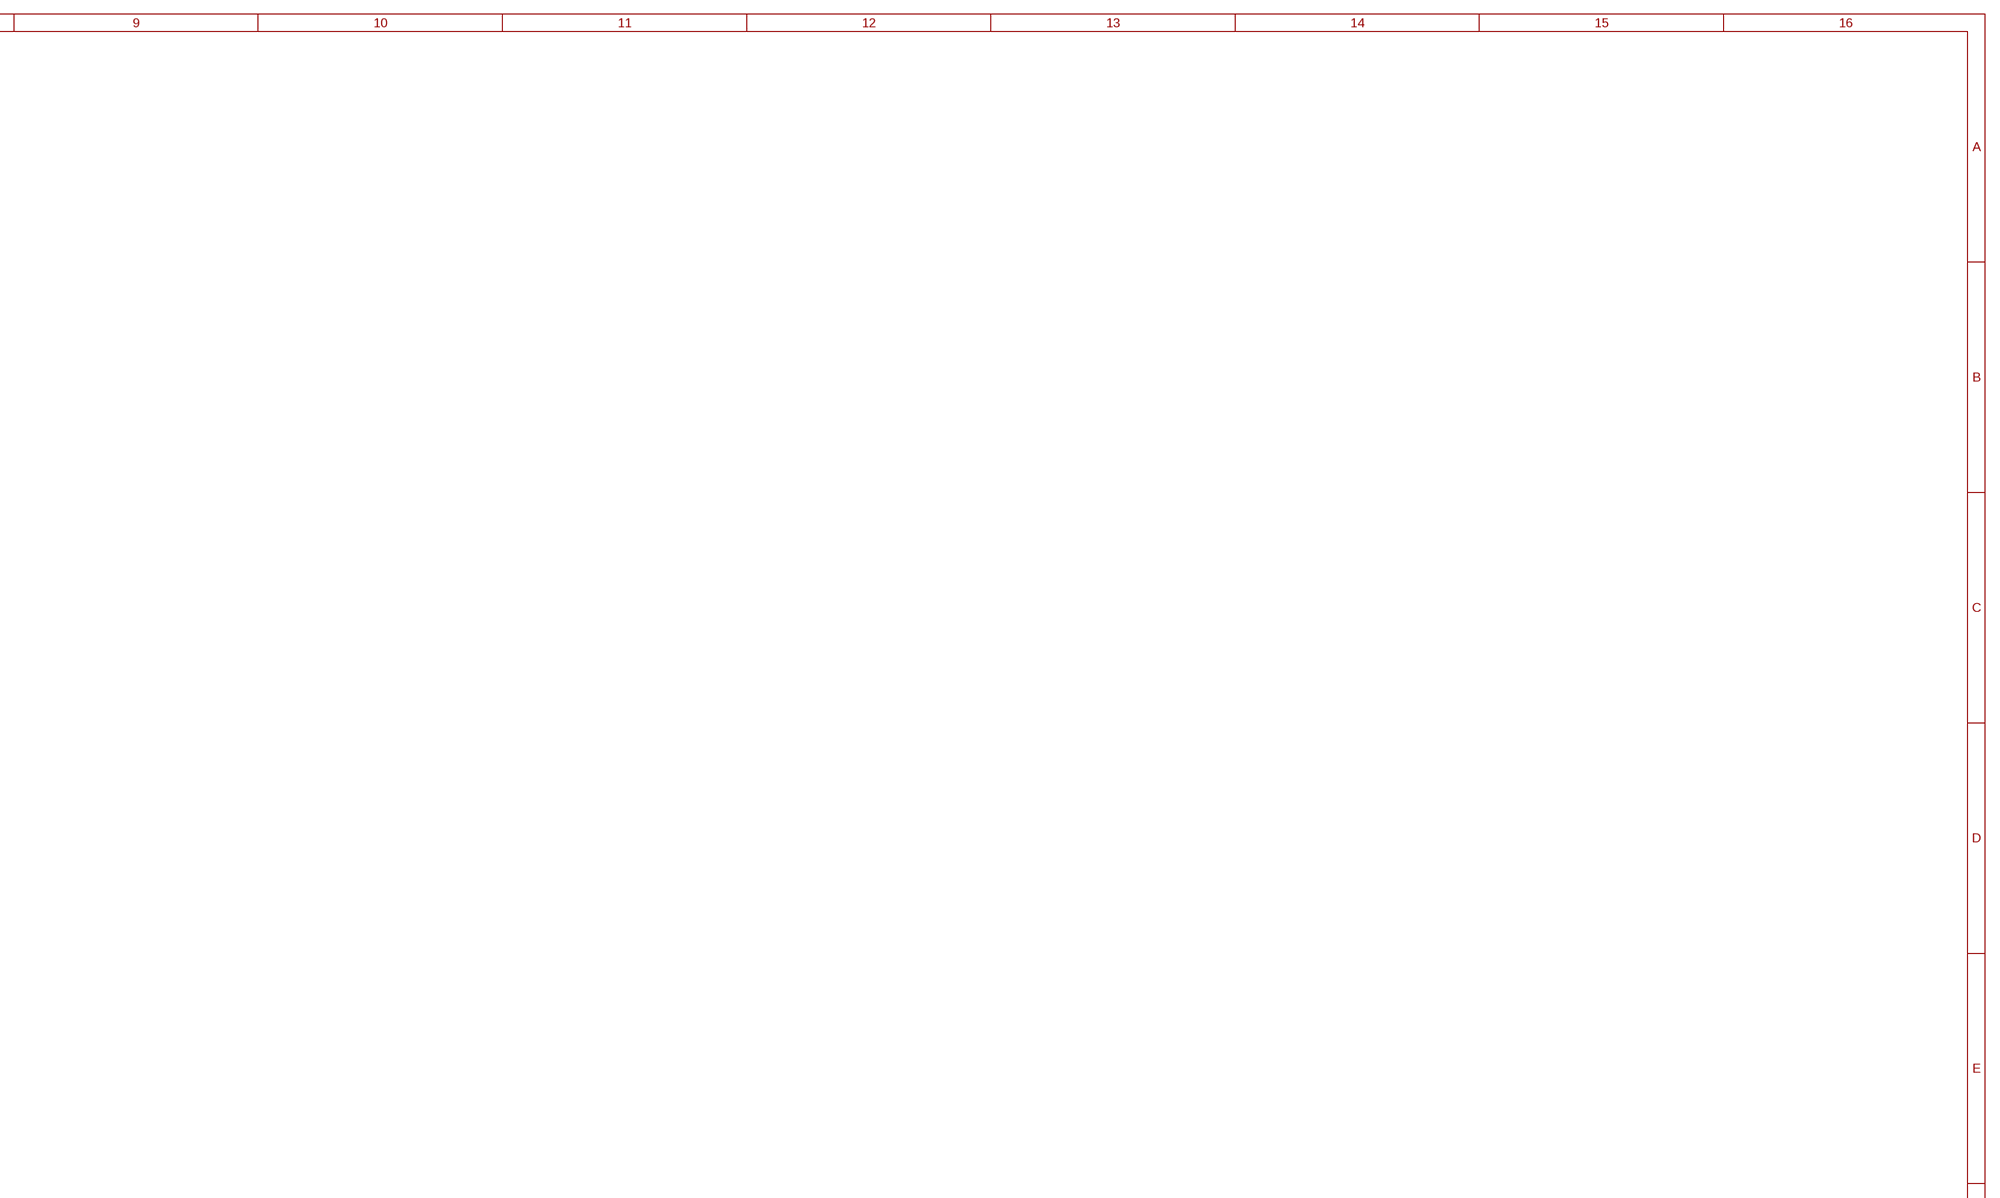
[diagram p4: schematic, sheet 2, part 2 of 3]
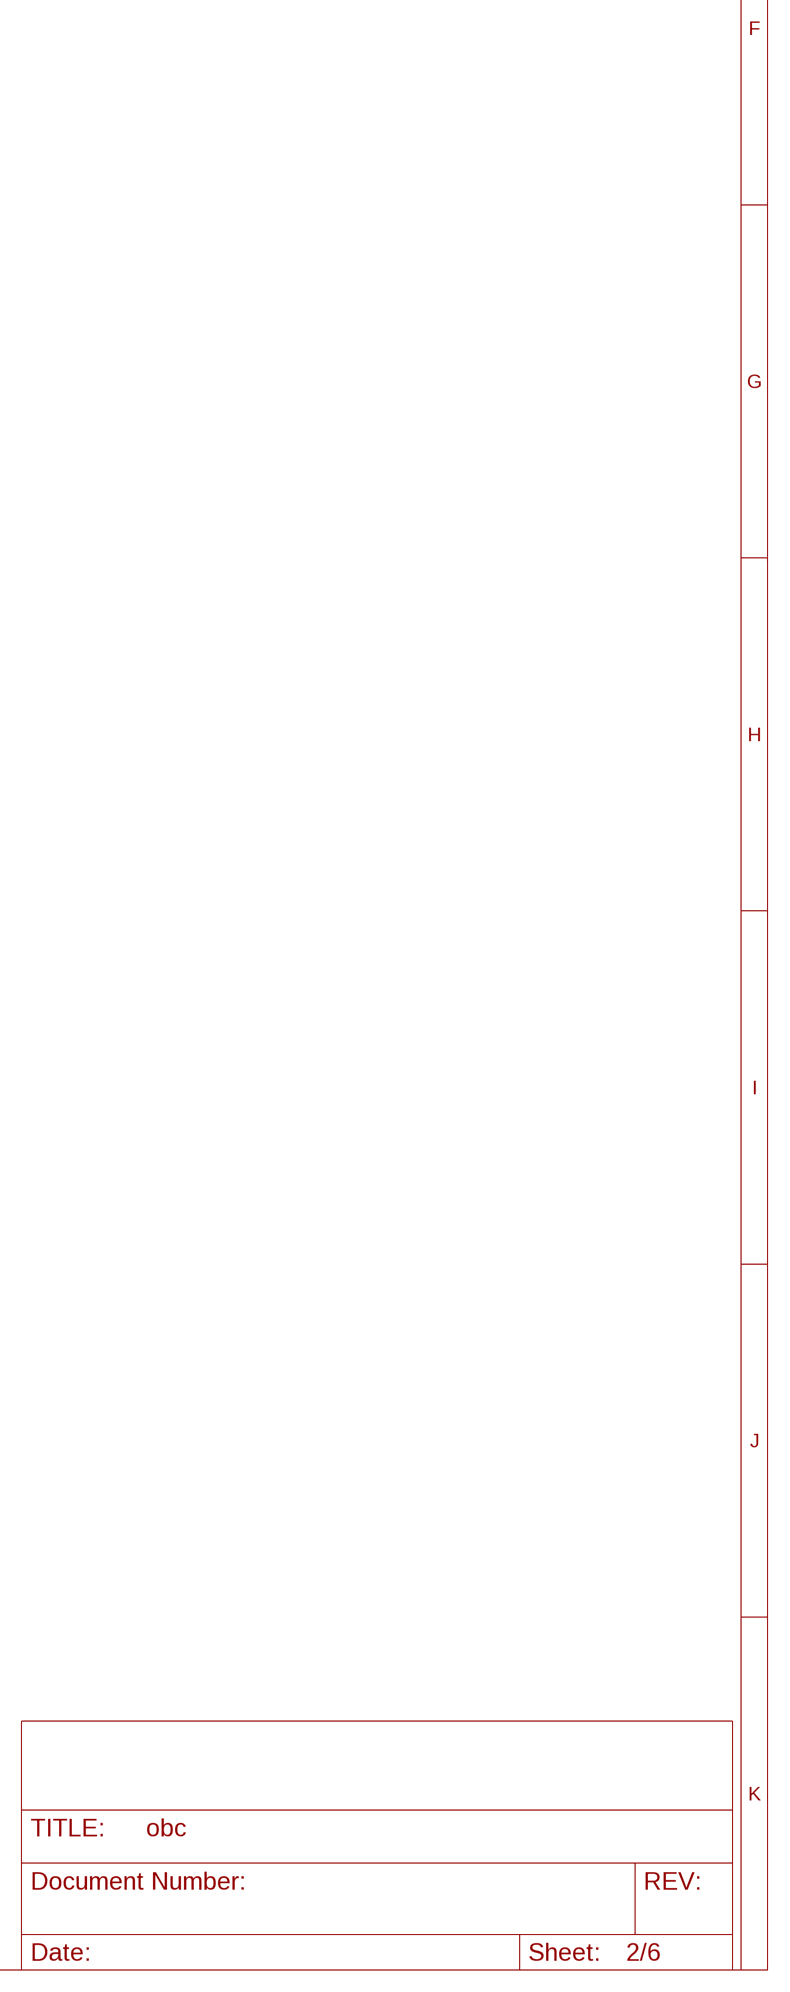
[diagram p5: schematic, sheet 2, part 3 of 3]

### Parts
C5  22uF  C-EUC0402K  [C0402K]
C6  4.7uF  C-EUC0402K  [C0402K]
C7  0.1uF  C-EUC0402K  [C0402K]
C8  0.1uF  C-EUC0402K  [C0402K]
C9  0.1uF  C-EUC0402K  [C0402K]
C10  0.1uF  C-EUC0402K  [C0402K]
C11  0.1uF  C-EUC0402K  [C0402K]
C12  0.1uF  C-EUC0402K  [C0402K]
C13  0.1uF  C-EUC0402K  [C0402K]
IC1  IS42S16160J-6BLI  [BGA54C80P9X9_800X800X120]
L1  120 Ohm  BLM15HB121SN1  [0402]
R13  0 Ohm  R-EU_R0402  [R0402]
R14  100K Ohm  R-EU_R0402  [R0402]
R15  100K Ohm  R-EU_R0402  [R0402]

### Nets
DCDC_3V3: L1.1 ; also sheet 1,4
GND: C5.2 C6.2 C7.2 C8.2 C9.2 C10.2 C11.2 C12.2 C13.2 IC1.A1(VSS_1) IC1.A3(VSSQ_1) IC1.B7(VSSQ_2) IC1.C3(VSSQ_3) IC1.D7(VSSQ_4) IC1.E3(VSS_2) IC1.J1(VSS_3) R14.1 ; also sheet 1,3,4,6
N$12: IC1.F3(CKE) R14.2
N$13: IC1.F2(CLK) R13.2
N$14: IC1.F1(DQMH)
N$15: IC1.E8(DQML)
N$16: IC1.G9(!CS) R15.1
N$17: R15.2
N$18: IC1.F9(!WE)
N$19: IC1.F8(!RAS)
N$20: IC1.F7(!CAS)
N$21: IC1.G8(BA1)
N$22: IC1.G7(BA0)
N$23: R13.1
N$24: IC1.J9(VDD_3)
N$25: IC1.E7(VDD_2)
N$28: IC1.A7(VDDQ_1) IC1.A9(VDD_1) IC1.B3(VDDQ_2) IC1.C7(VDDQ_3) IC1.D3(VDDQ_4)
SDRAM_3V3: C5.1 C6.1 C7.1 C8.1 C9.1 C10.1 C11.1 C12.1 C13.1 L1.2
SEMC_A0: IC1.H7(A0) ; also sheet 1
SEMC_A1: IC1.H8(A1) ; also sheet 1
SEMC_A2: IC1.J8(A2) ; also sheet 1
SEMC_A3: IC1.J7(A3) ; also sheet 1
SEMC_A4: IC1.J3(A4) ; also sheet 1
SEMC_A5: IC1.J2(A5) ; also sheet 1
SEMC_A6: IC1.H3(A6) ; also sheet 1
SEMC_A7: IC1.H2(A7) ; also sheet 1
SEMC_A8: IC1.H1(A8) ; also sheet 1
SEMC_A9: IC1.G3(A9) ; also sheet 1
SEMC_A10: IC1.H9(A10) ; also sheet 1
SEMC_A11: IC1.G2(A11) ; also sheet 1
SEMC_A12: IC1.G1(A12) ; also sheet 1
SEMC_D0: IC1.A8(DQ0) ; also sheet 1
SEMC_D1: IC1.B9(DQ1) ; also sheet 1
SEMC_D2: IC1.B8(DQ2) ; also sheet 1
SEMC_D3: IC1.C9(DQ3) ; also sheet 1
SEMC_D4: IC1.C8(DQ4) ; also sheet 1
SEMC_D5: IC1.D9(DQ5) ; also sheet 1
SEMC_D6: IC1.D8(DQ6) ; also sheet 1
SEMC_D7: IC1.E9(DQ7) ; also sheet 1
SEMC_D8: IC1.E1(DQ8) ; also sheet 1
SEMC_D9: IC1.D2(DQ9) ; also sheet 1
SEMC_D10: IC1.D1(DQ10) ; also sheet 1
SEMC_D11: IC1.C2(DQ11) ; also sheet 1
SEMC_D12: IC1.C1(DQ12) ; also sheet 1
SEMC_D13: IC1.B2(DQ13) ; also sheet 1
SEMC_D14: IC1.B1(DQ14) ; also sheet 1
SEMC_D15: IC1.A2(DQ15) ; also sheet 1
Unconnected: IC1.E2(NC)

## Sheet 3 of 6: HyperFlash
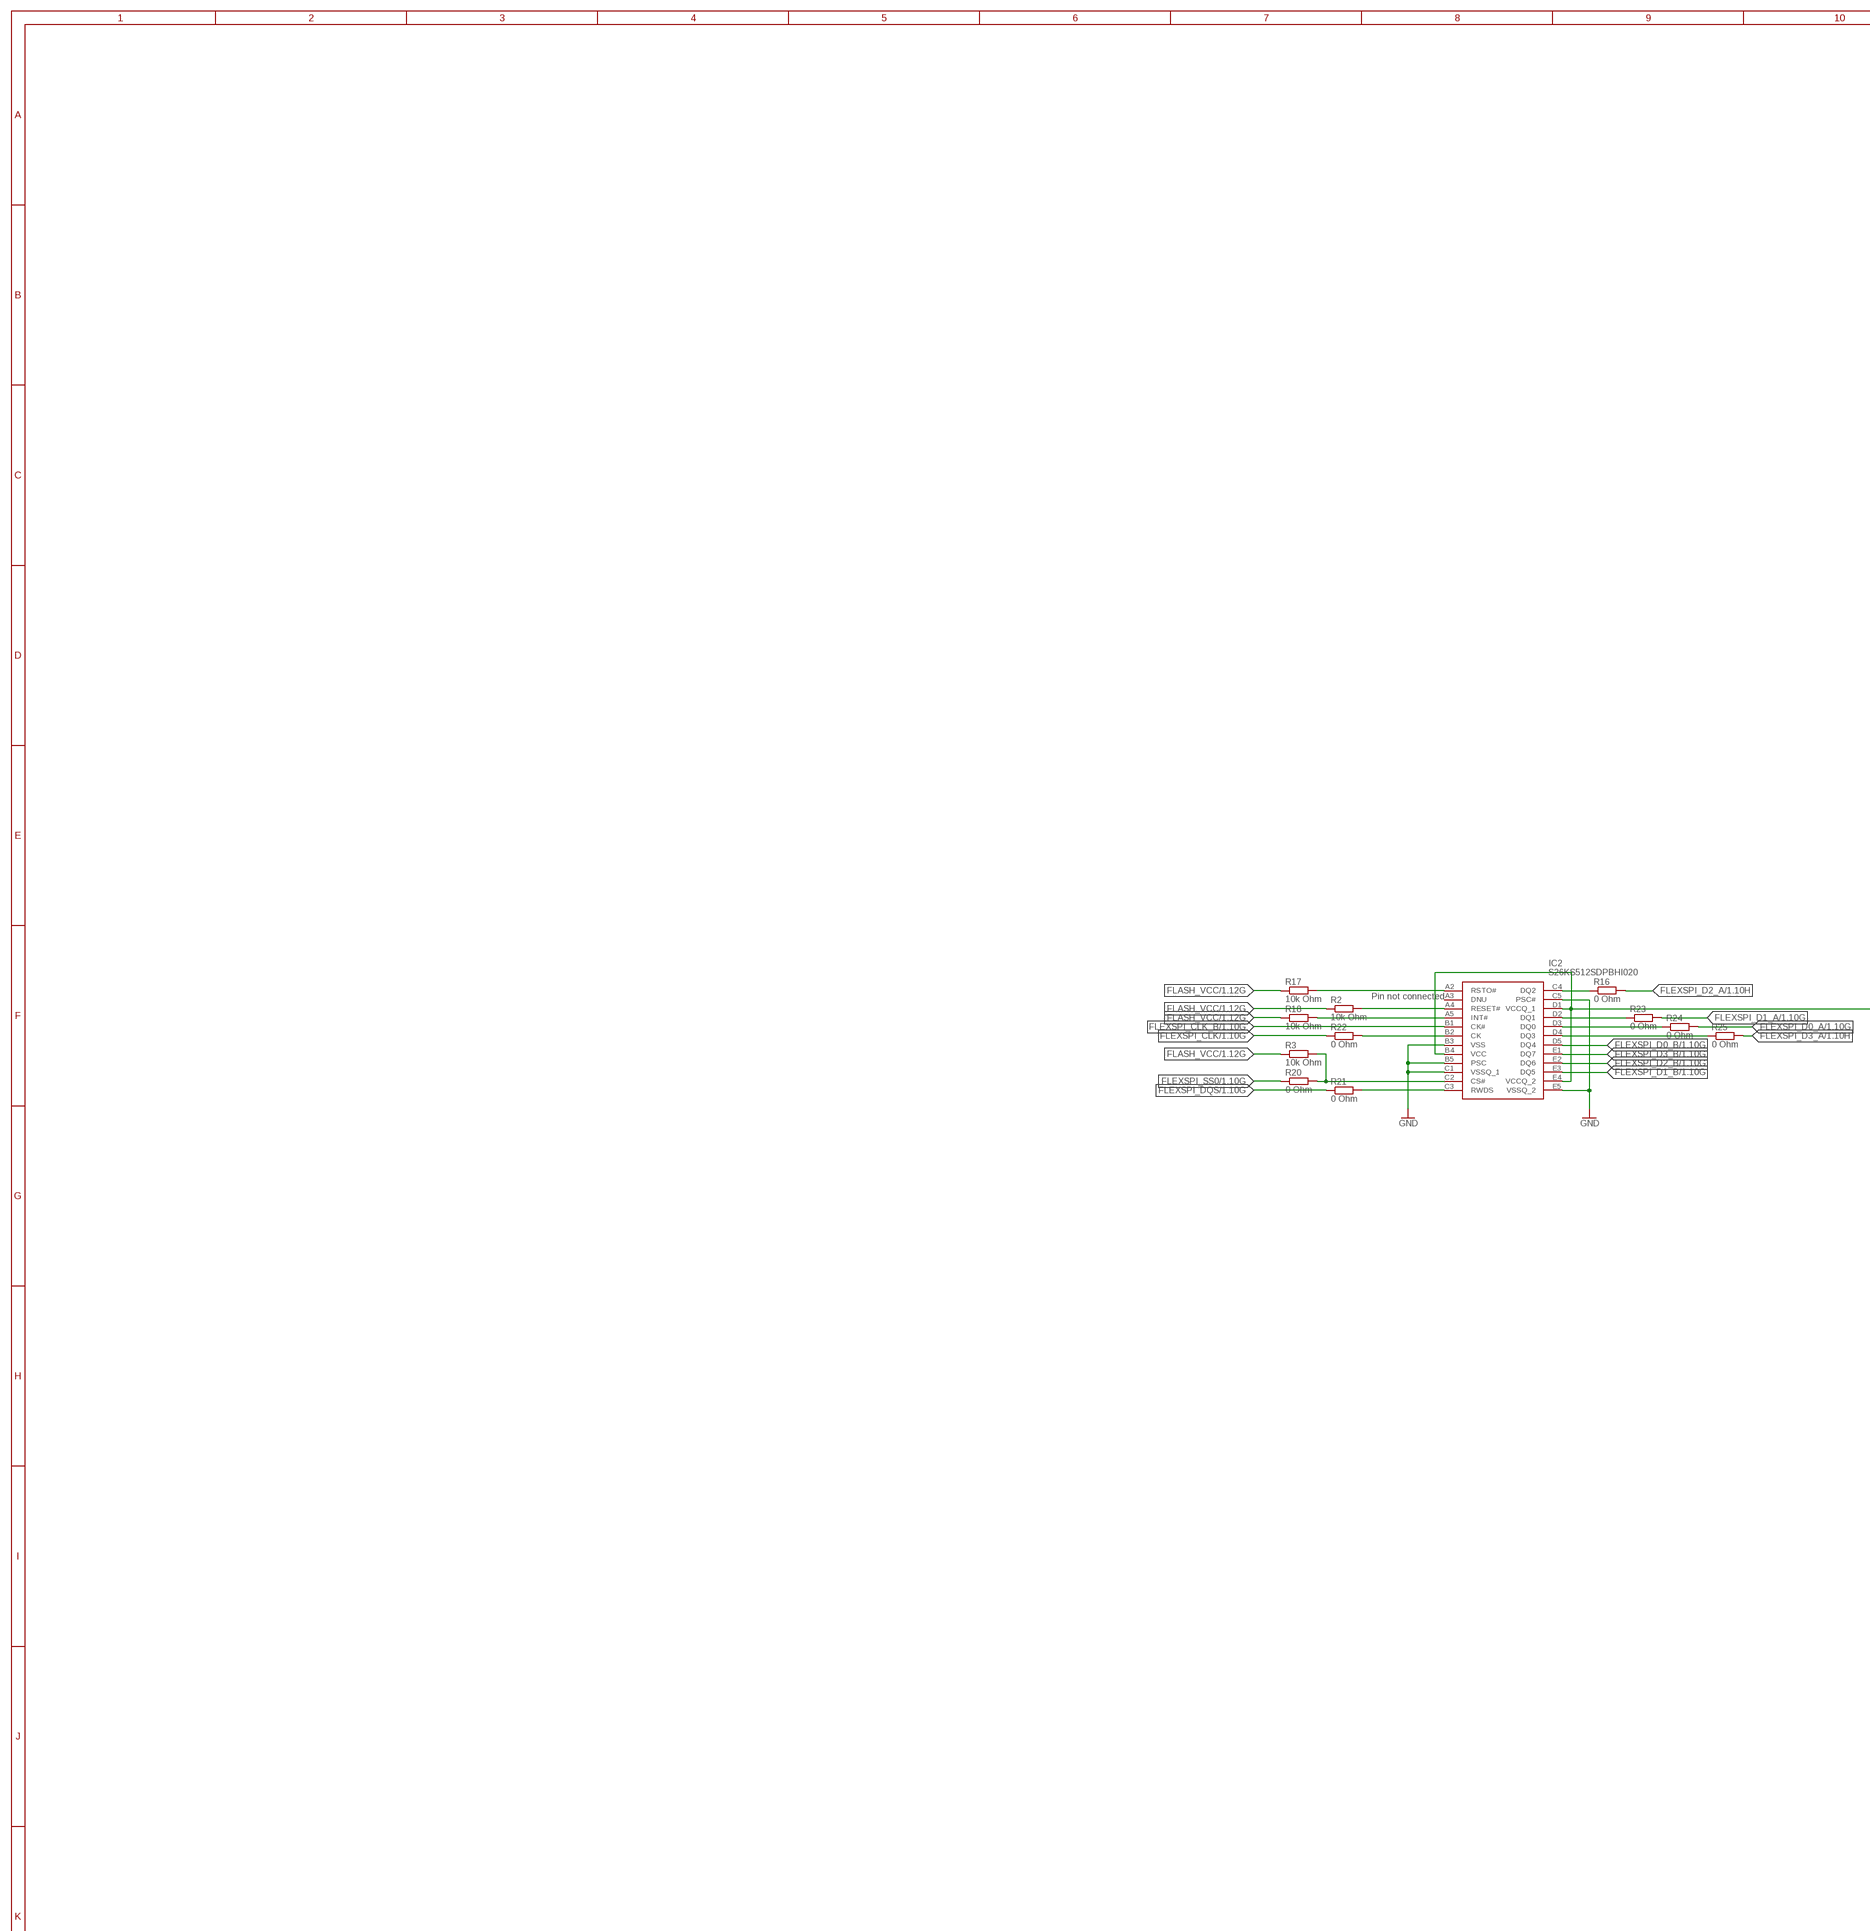
[diagram p6: schematic, sheet 3, part 1 of 3]
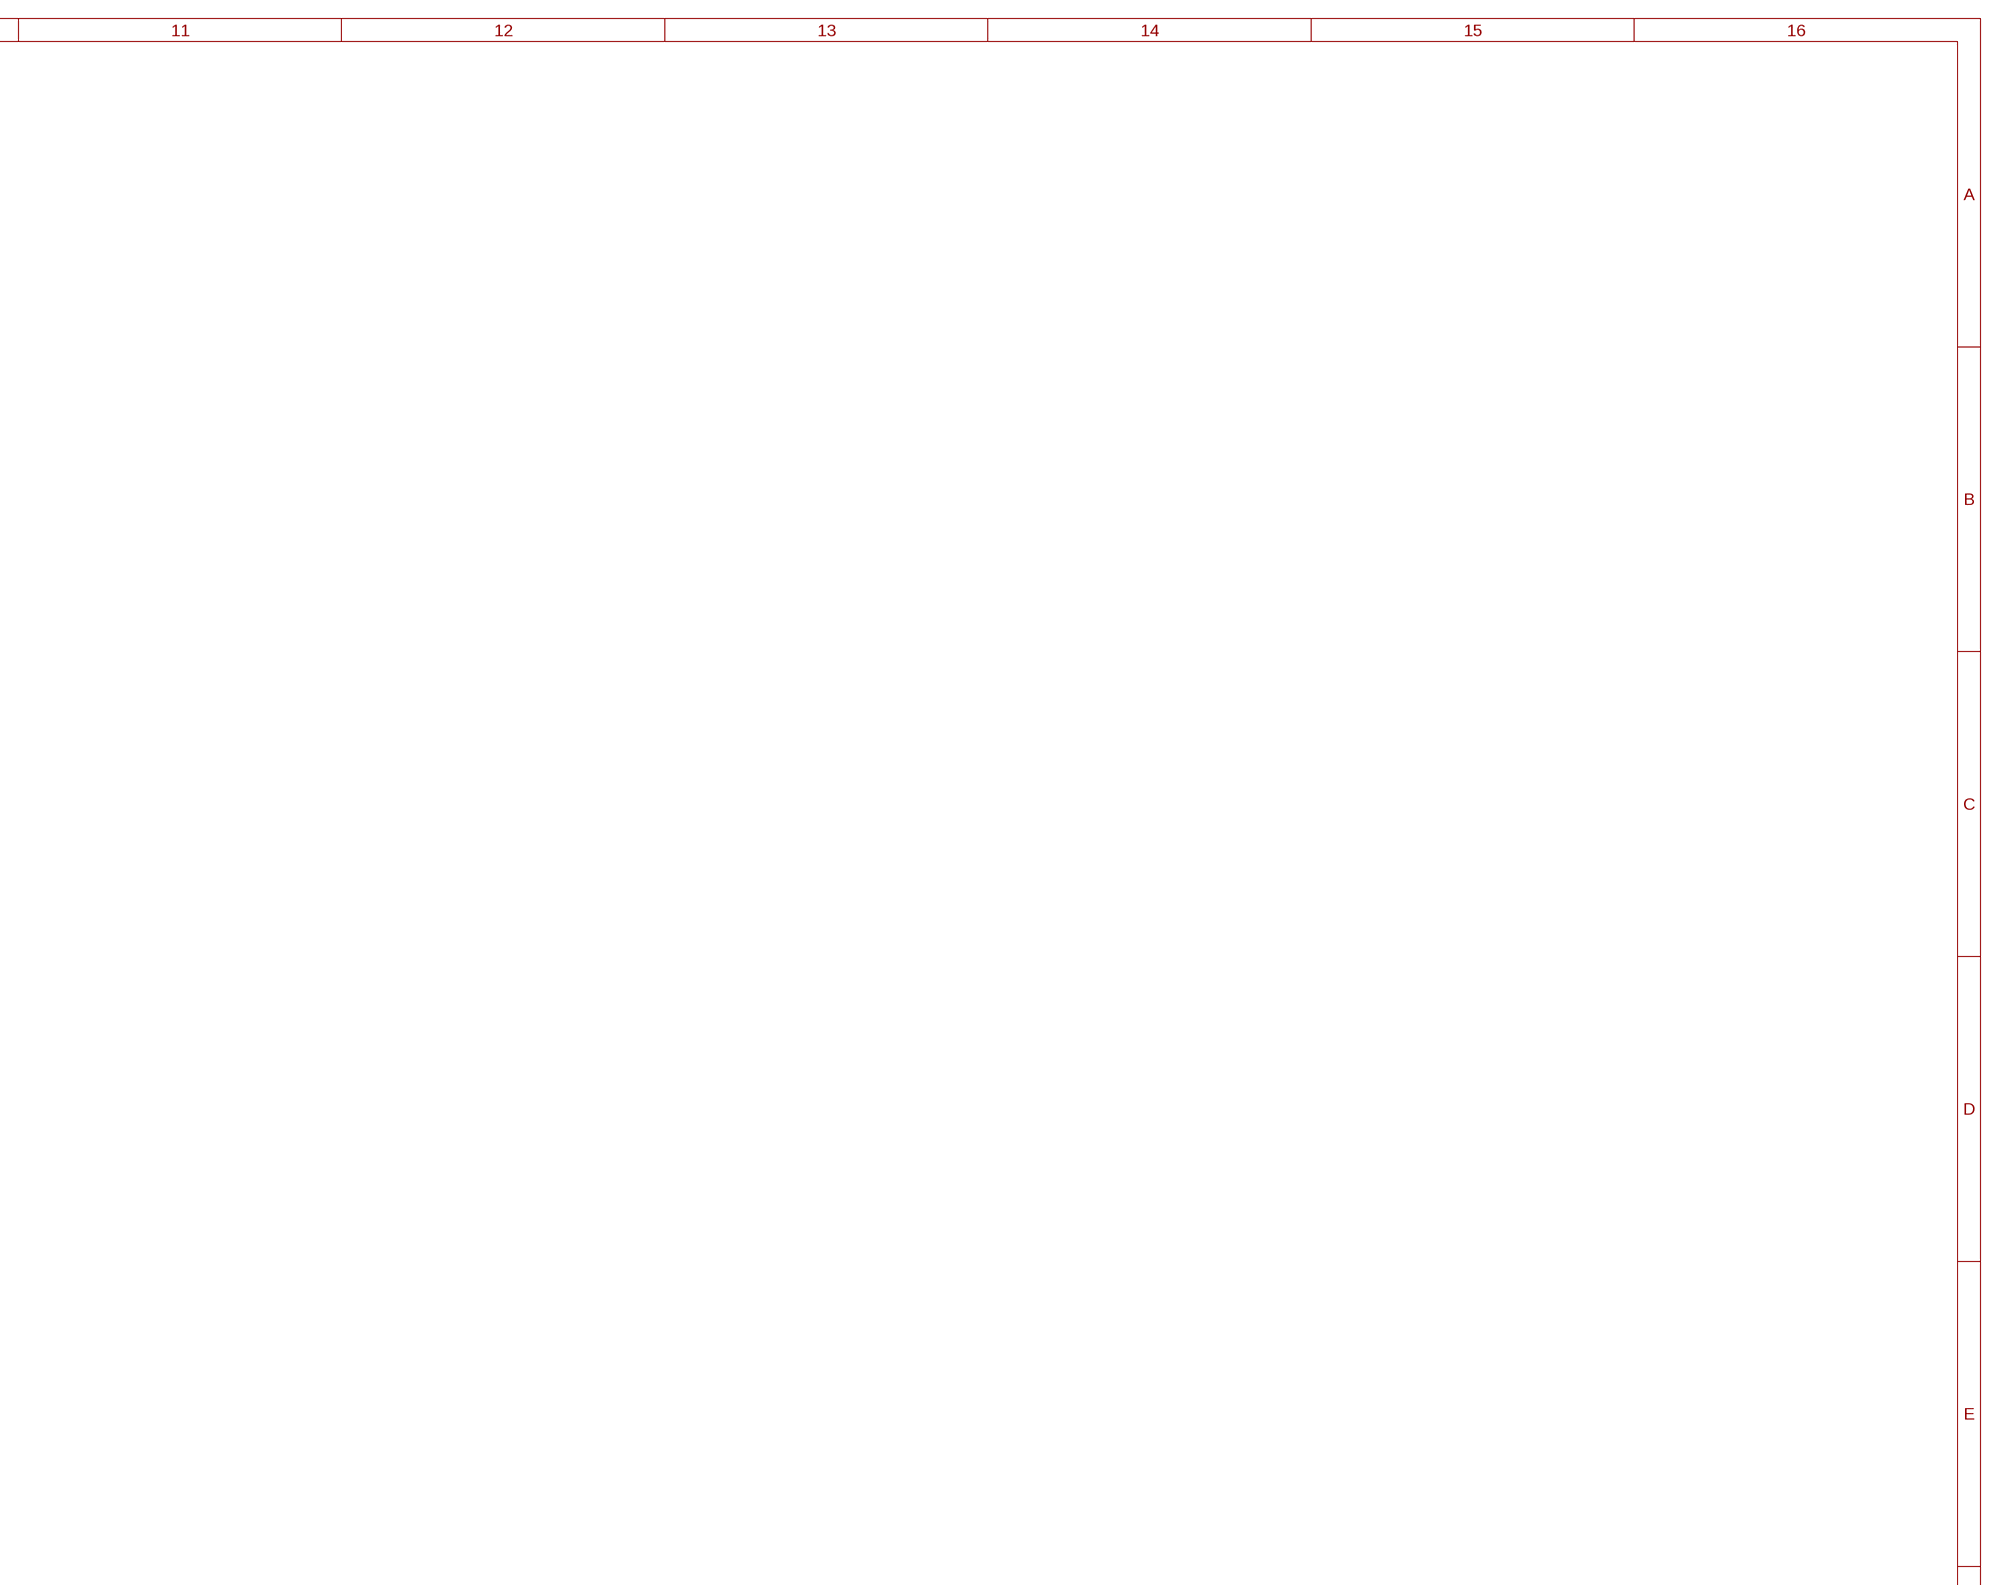
[diagram p7: schematic, sheet 3, part 2 of 3]
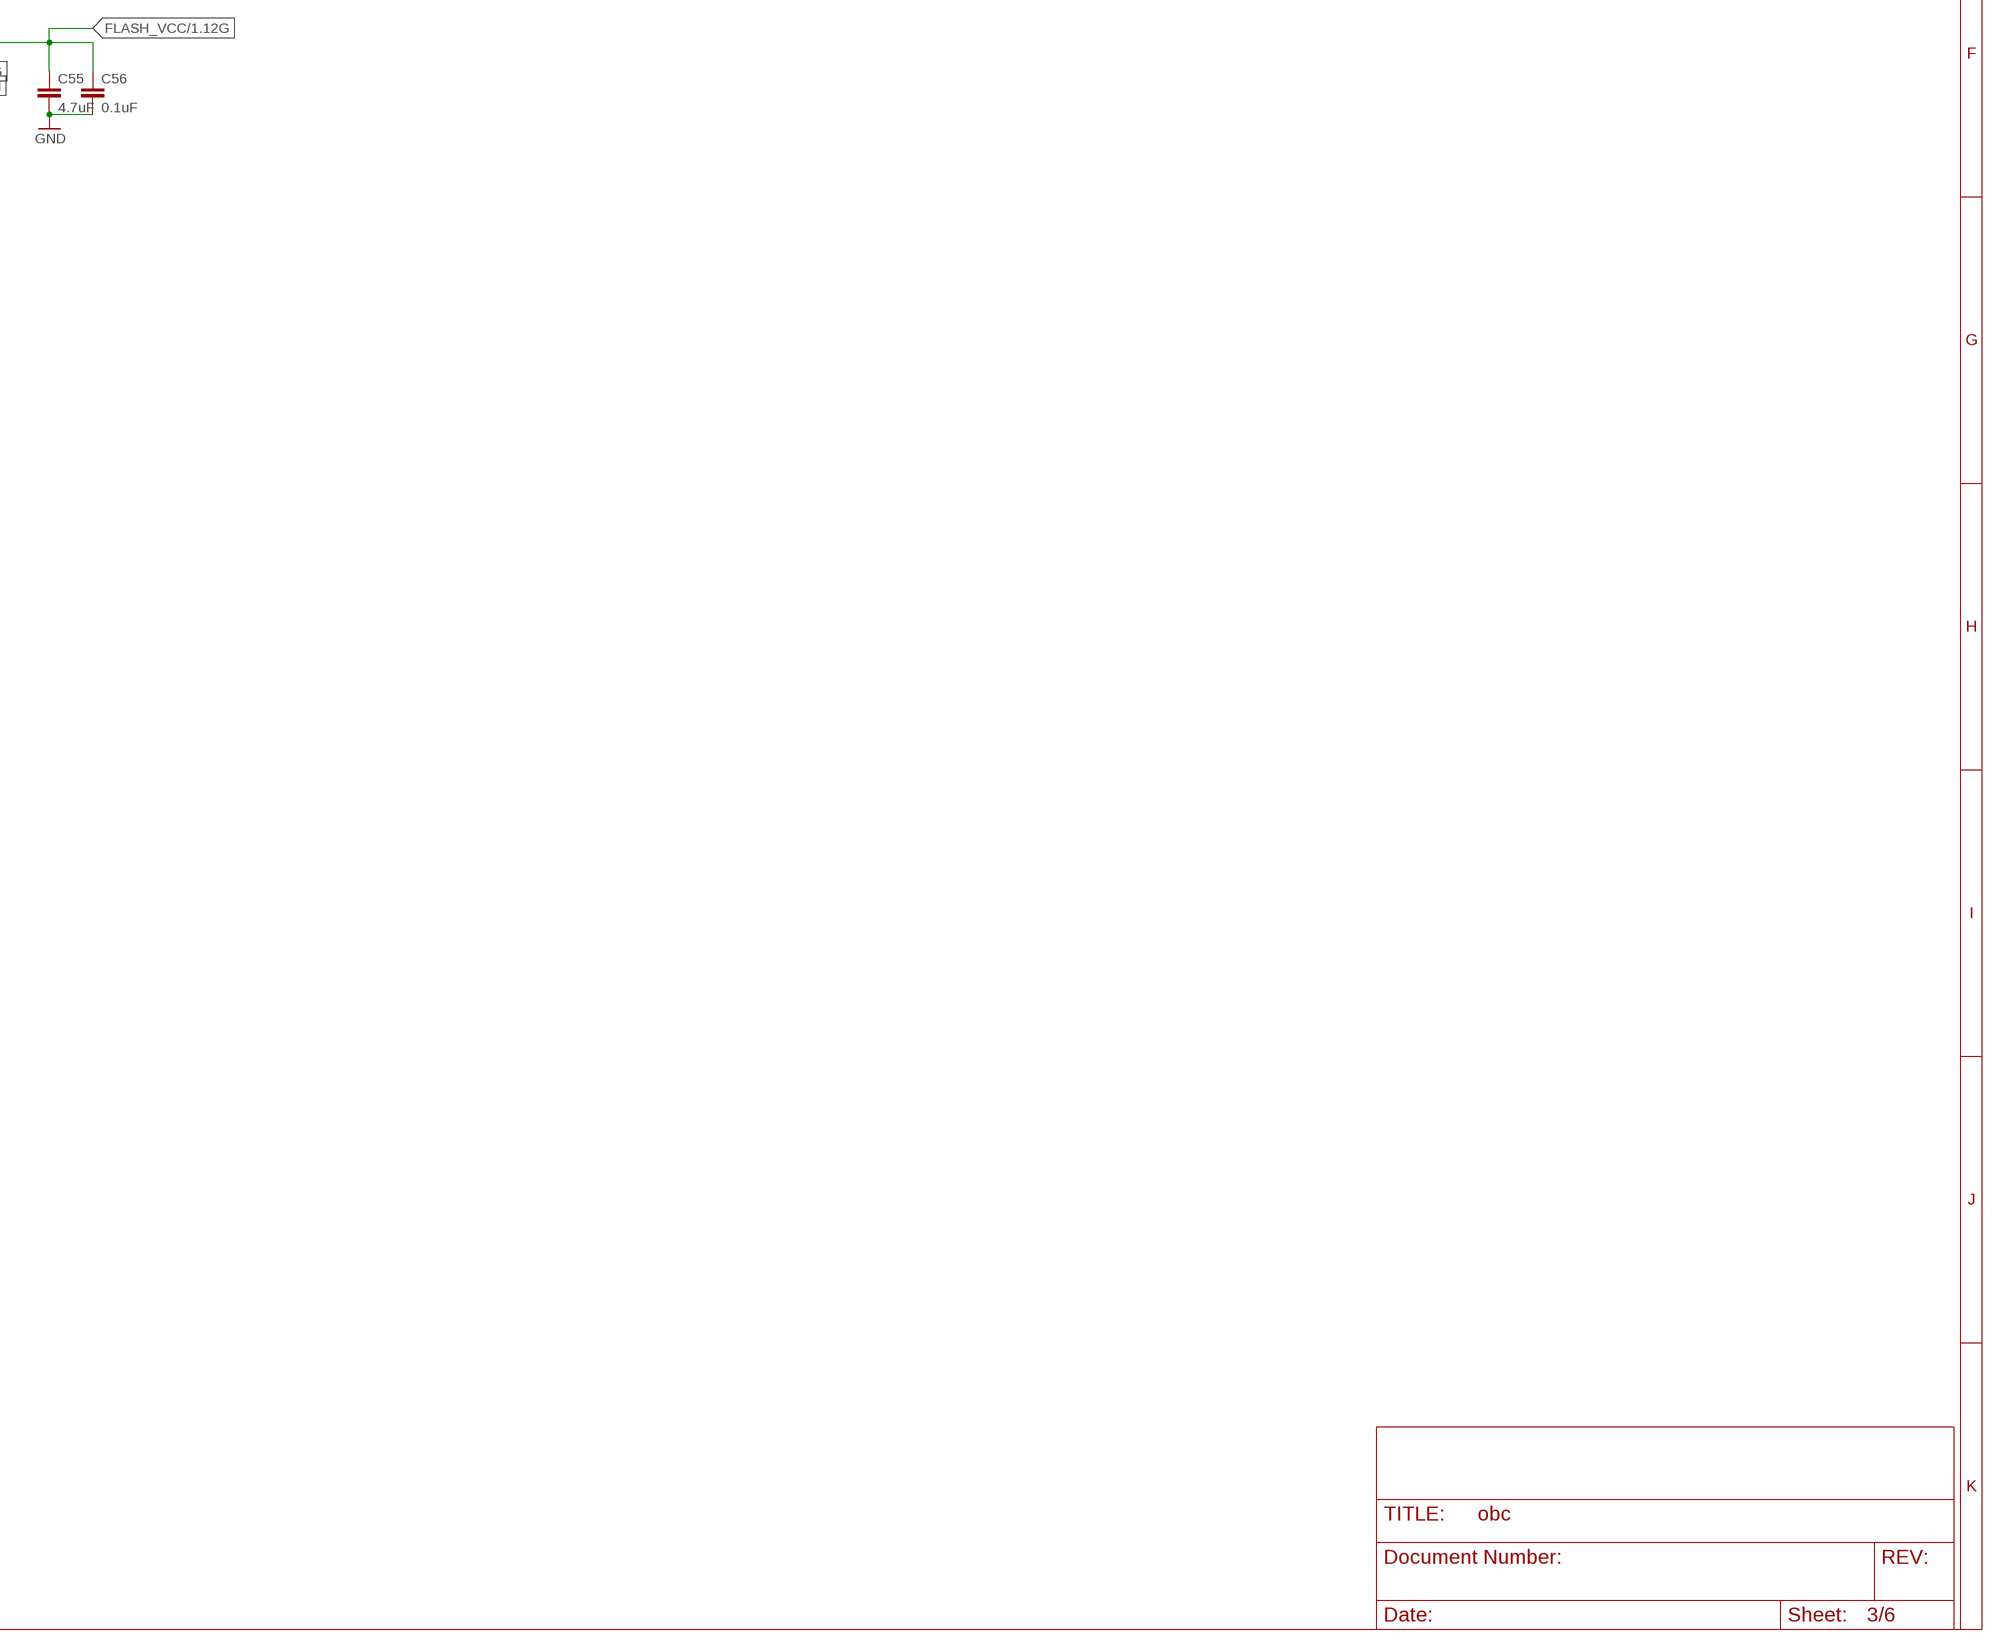
[diagram p8: schematic, sheet 3, part 3 of 3]

### Parts
C55  4.7uF  C-EUC0402K  [C0402K]
C56  0.1uF  C-EUC0402K  [C0402K]
IC2  S26KS512SDPBHI020  [BGA24C100P5X5_600X800X100]
R2  10k Ohm  R-EU_R0402  [R0402]
R3  10k Ohm  R-EU_R0402  [R0402]
R16  0 Ohm  R-EU_R0402  [R0402]
R17  10k Ohm  R-EU_R0402  [R0402]
R18  10k Ohm  R-EU_R0402  [R0402]
R20  0 Ohm  R-EU_R0402  [R0402]
R21  0 Ohm  R-EU_R0402  [R0402]
R22  0 Ohm  R-EU_R0402  [R0402]
R23  0 Ohm  R-EU_R0402  [R0402]
R24  0 Ohm  R-EU_R0402  [R0402]
R25  0 Ohm  R-EU_R0402  [R0402]

### Nets
FLASH_VCC: C55.1 C56.1 IC2.B4(VCC) IC2.D1(VCCQ_1) IC2.E4(VCCQ_2) R2.1 R3.1 R17.1 R18.1 ; also sheet 1
FLEXSPI_CLK: R22.1 ; also sheet 1
FLEXSPI_CLK_B: IC2.B1(CK#) ; also sheet 1
FLEXSPI_D0_A: R24.2 ; also sheet 1
FLEXSPI_D0_B: IC2.D5(DQ4) ; also sheet 1
FLEXSPI_D1_A: R23.2 ; also sheet 1
FLEXSPI_D1_B: IC2.E3(DQ5) ; also sheet 1
FLEXSPI_D2_A: R16.2 ; also sheet 1
FLEXSPI_D2_B: IC2.E2(DQ6) ; also sheet 1
FLEXSPI_D3_A: R25.2 ; also sheet 1
FLEXSPI_D3_B: IC2.E1(DQ7) ; also sheet 1
FLEXSPI_DQS: R21.1 ; also sheet 1
FLEXSPI_SS0: R20.1 ; also sheet 1
GND: C55.2 C56.2 IC2.B3(VSS) IC2.B5(PSC) IC2.C1(VSSQ_1) IC2.C5(PSC#) IC2.E5(VSSQ_2) ; also sheet 1,2,4,6
N$8: IC2.A2(RSTO#) R17.2
N$26: IC2.C4(DQ2) R16.1
N$27: IC2.A5(INT#) R18.2
N$29: IC2.A4(RESET#) R2.2
N$31: IC2.C2(CS#) R3.2 R20.2
N$32: IC2.C3(RWDS) R21.2
N$33: IC2.D2(DQ1) R23.1
N$34: IC2.B2(CK) R22.2
N$35: IC2.D3(DQ0) R24.1
N$36: IC2.D4(DQ3) R25.1
Unconnected: IC2.A3(DNU)

### Notes on the sheet
- Pin not connected

## Sheet 4 of 6: JTAG
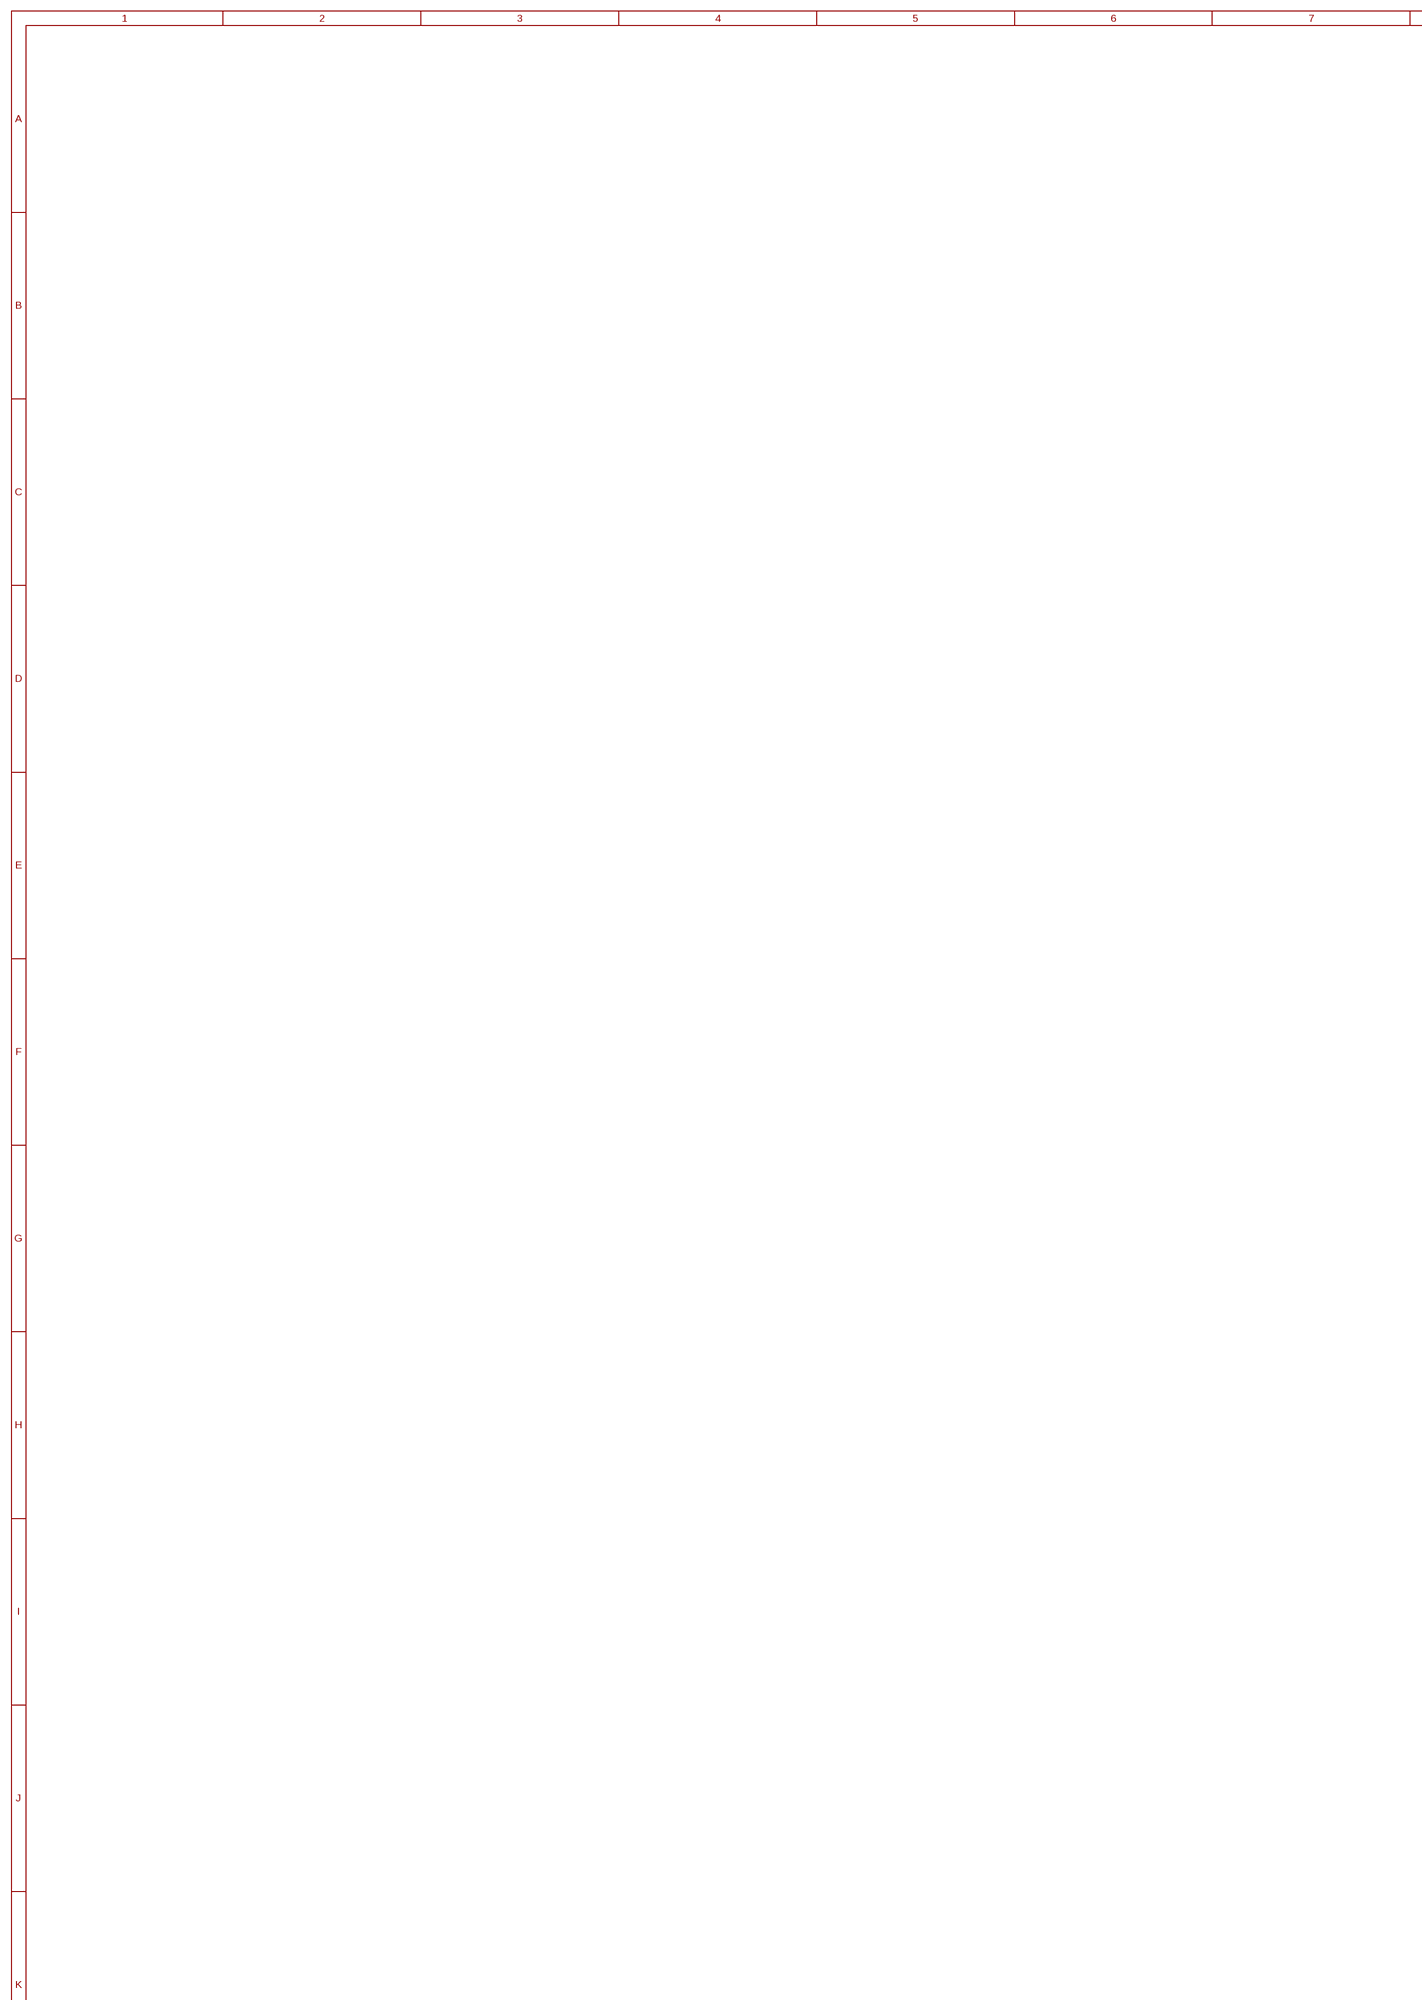
[diagram p9: schematic, sheet 4, part 1 of 2]
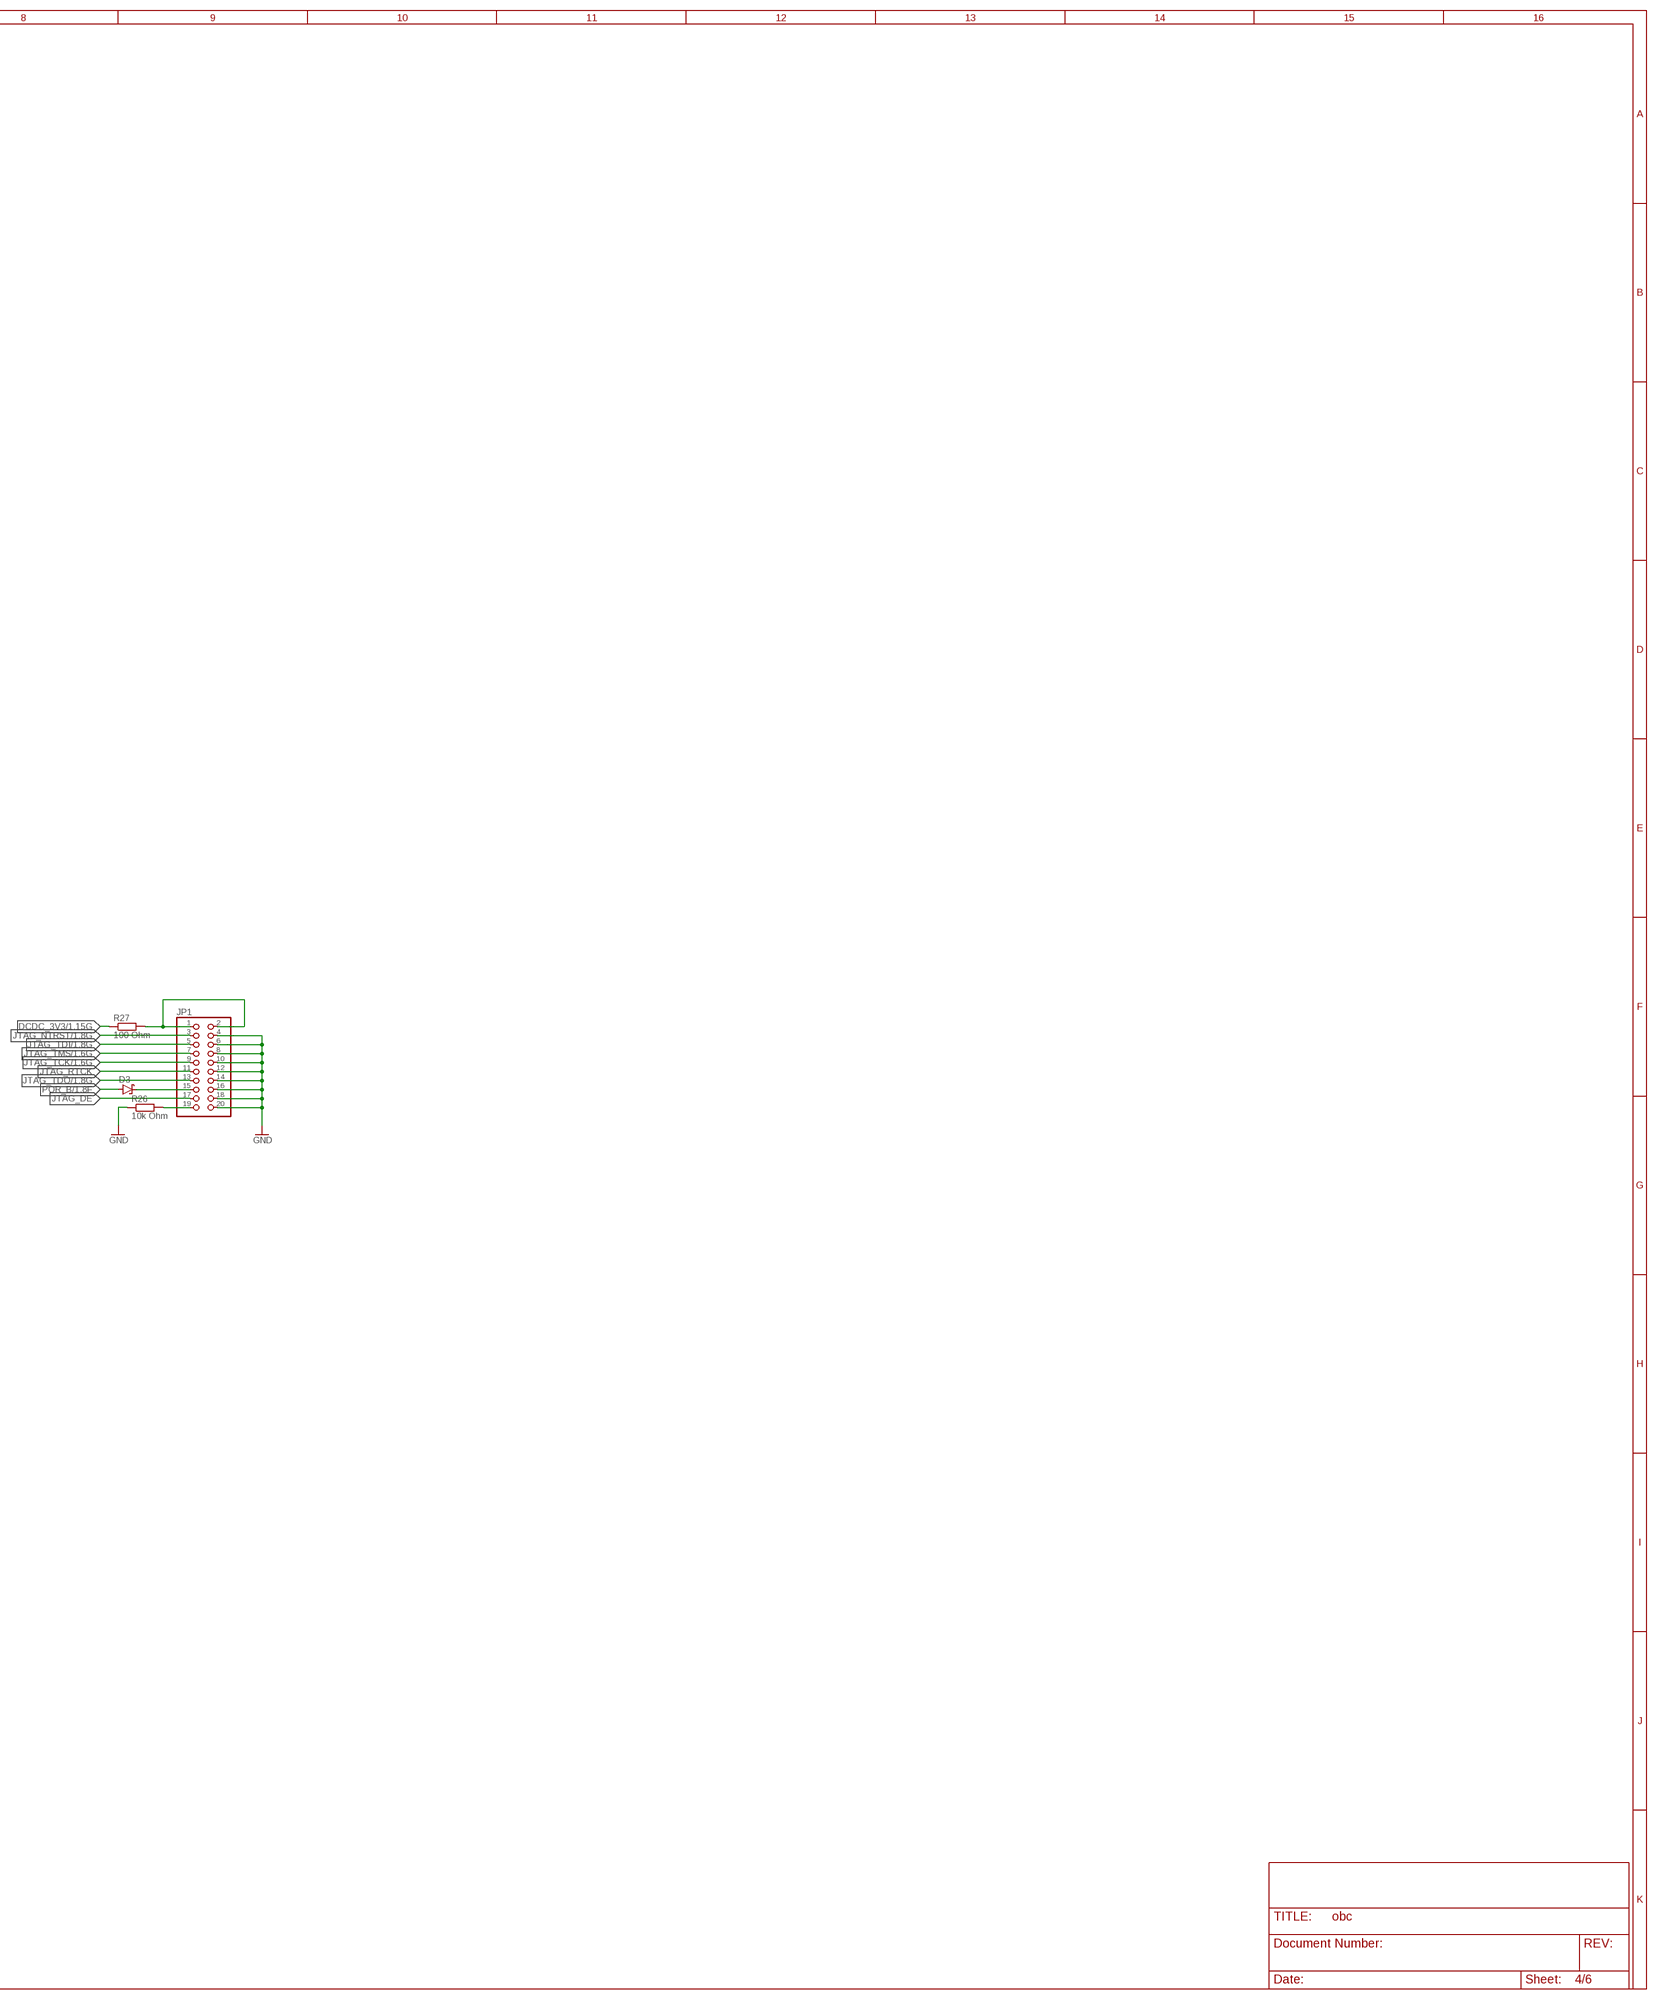
[diagram p10: schematic, sheet 4, part 2 of 2]

### Parts
D3  SCHOTTKY-DIODESMC  [SMC]
JP1  PINHD-2X10  [2X10]
R26  10k Ohm  R-EU_R0402  [R0402]
R27  100 Ohm  R-EU_R0402  [R0402]

### Nets
DCDC_3V3: R27.1 ; also sheet 1,2
GND: JP1.4 JP1.6 JP1.8 JP1.10 JP1.12 JP1.14 JP1.16 JP1.18 JP1.20 R26.1 ; also sheet 1,2,3,6
JTAG_DE: JP1.17
JTAG_NTRST: JP1.3 ; also sheet 1
JTAG_RTCK: JP1.11
JTAG_TCK: JP1.9 ; also sheet 1
JTAG_TDI: JP1.5 ; also sheet 1
JTAG_TDO: JP1.13 ; also sheet 1
JTAG_TMS: JP1.7 ; also sheet 1
N$37: JP1.19 R26.2
N$38: JP1.1 JP1.2 R27.2
N$39: D3.C JP1.15
POR_B: D3.A ; also sheet 1

## Sheet 5 of 6: PC104 Header
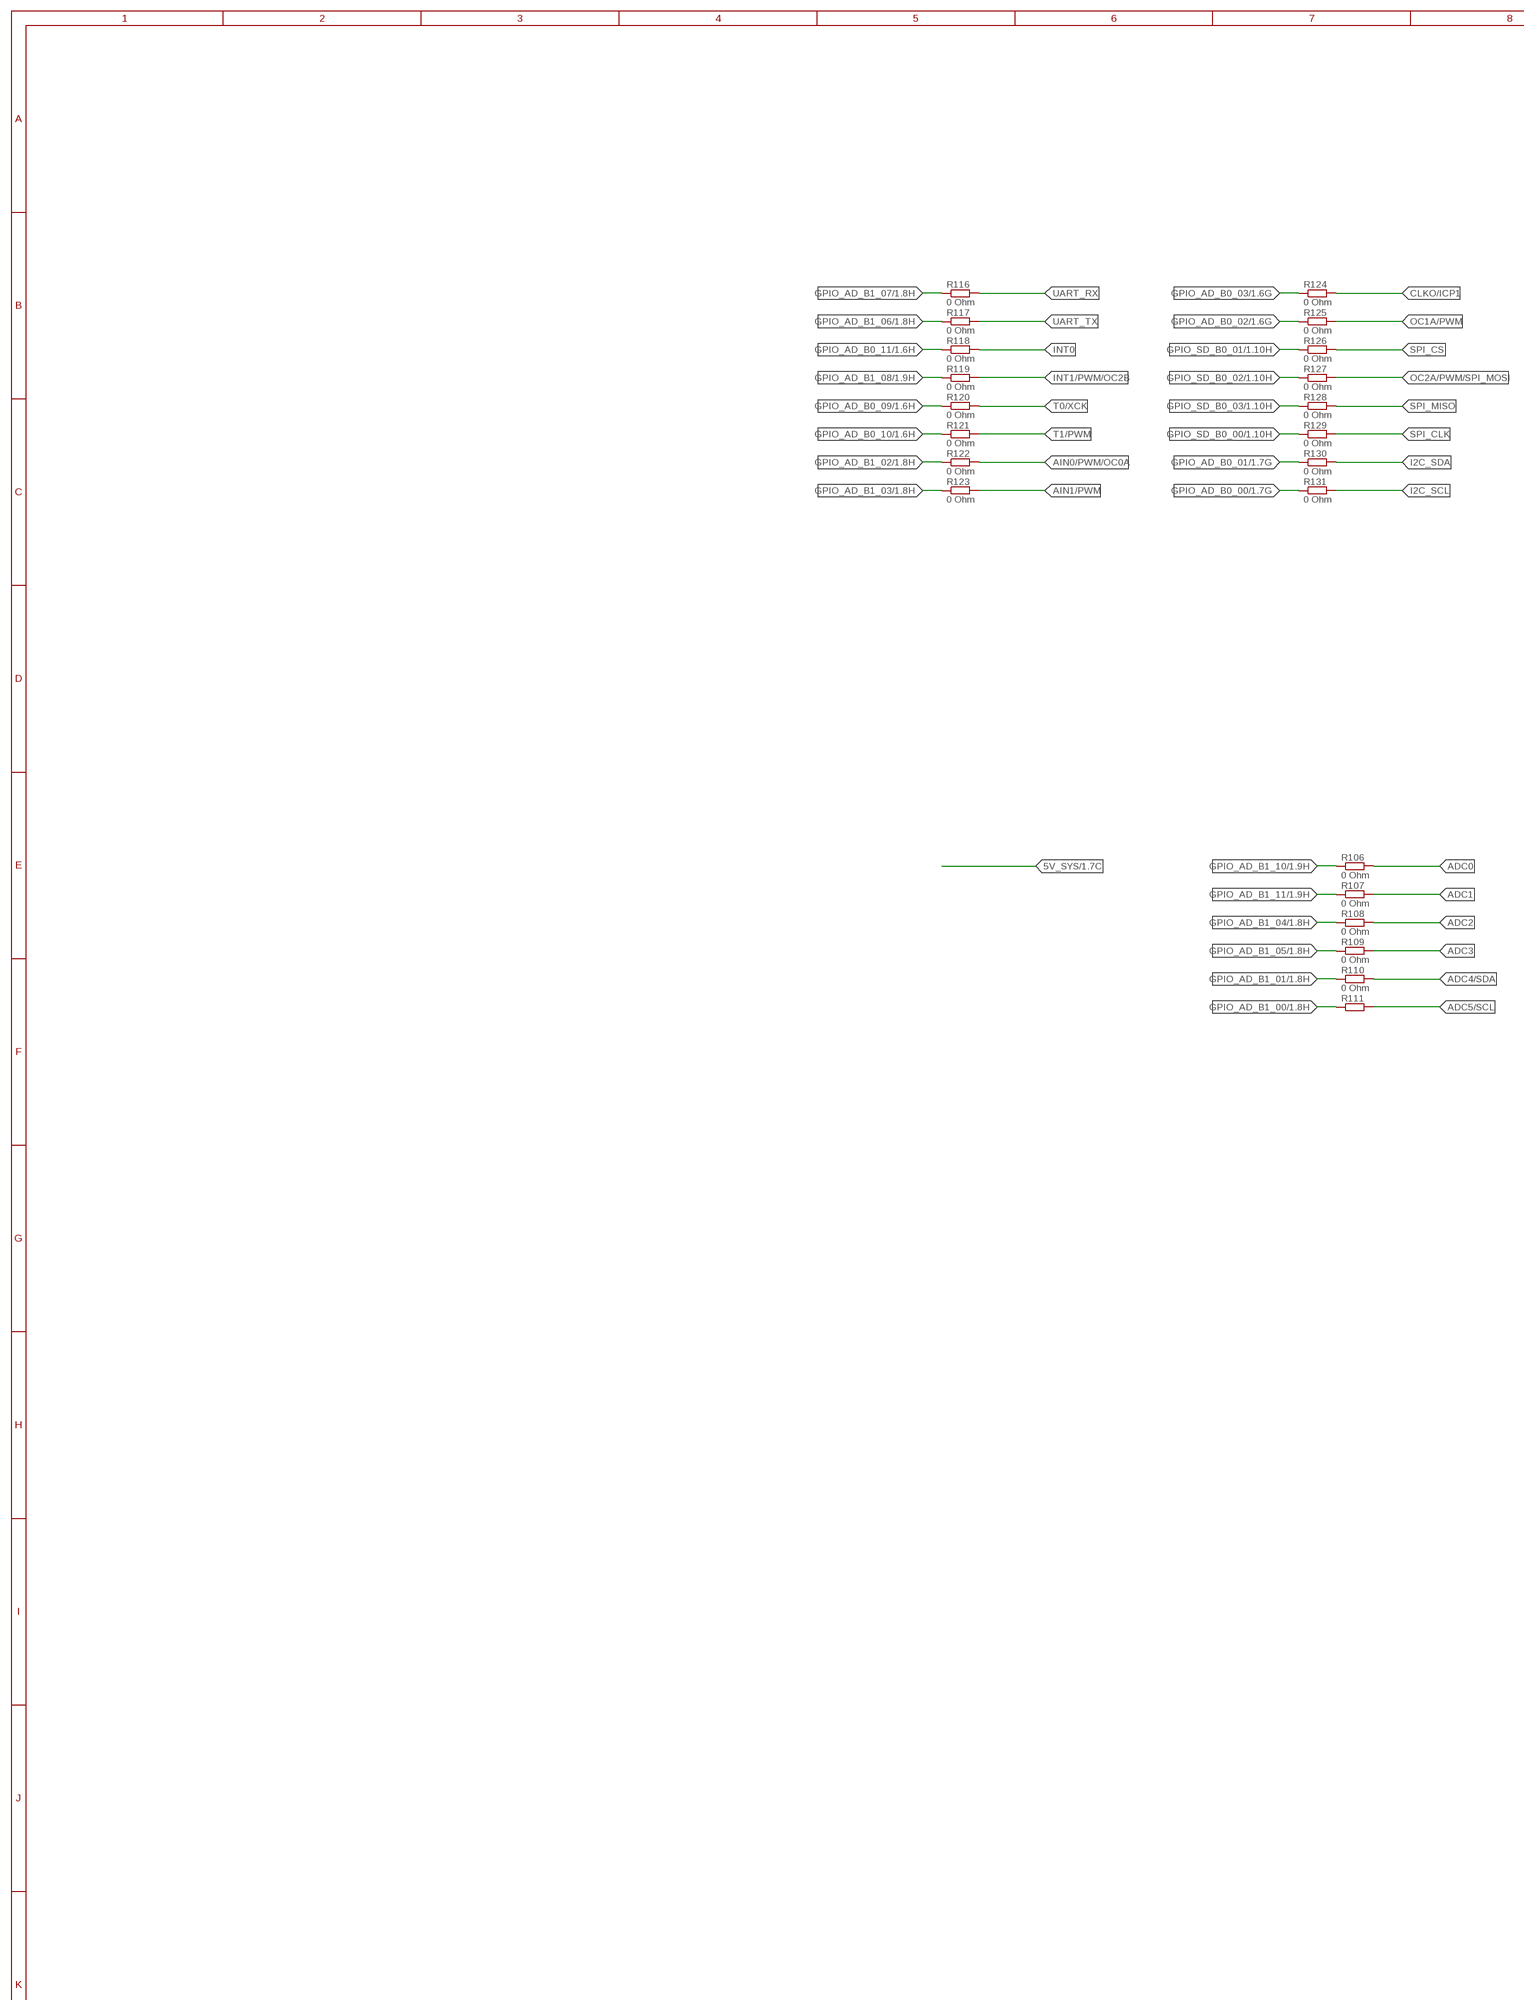
[diagram p11: schematic, sheet 5, part 1 of 3]
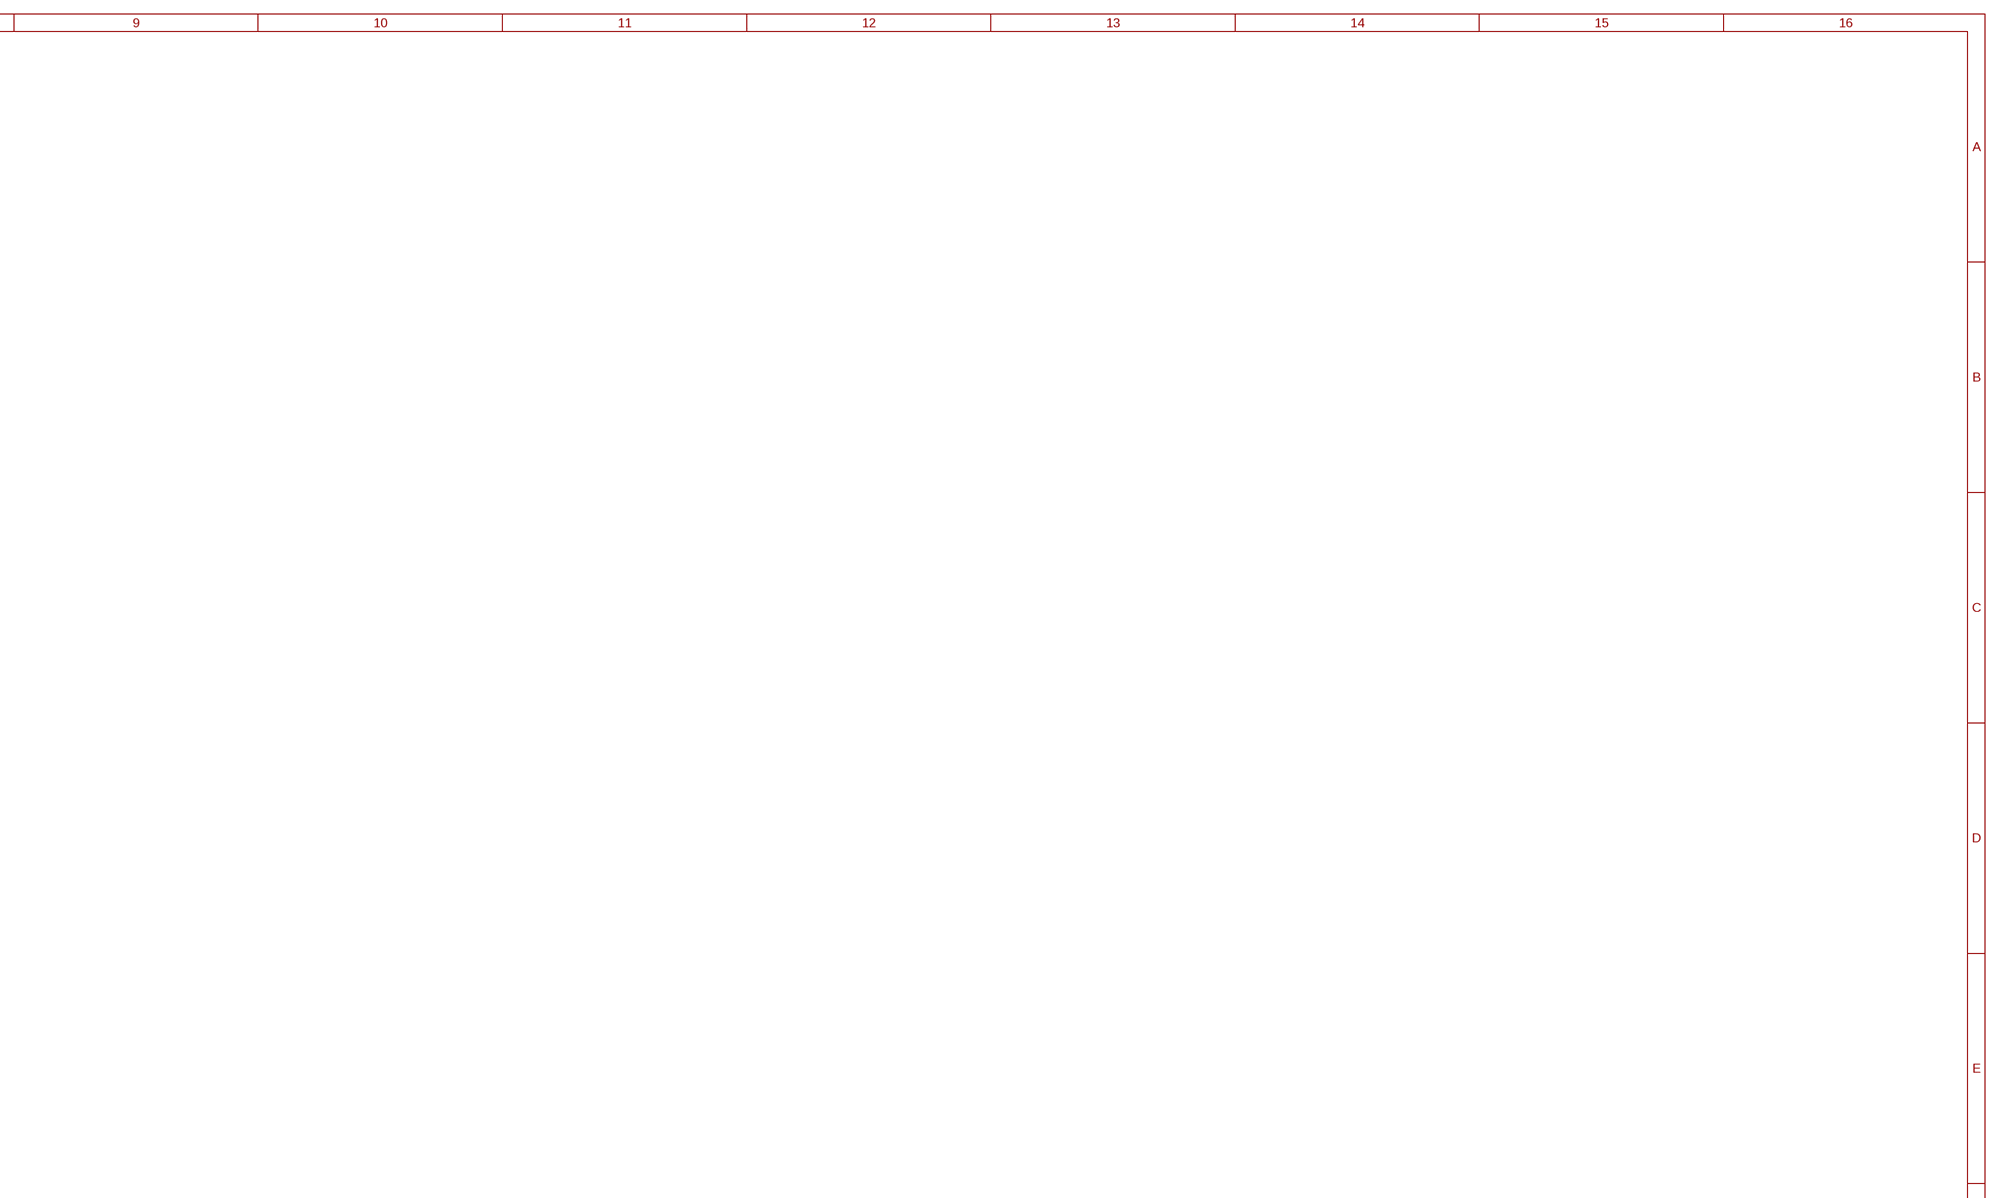
[diagram p12: schematic, sheet 5, part 2 of 3]
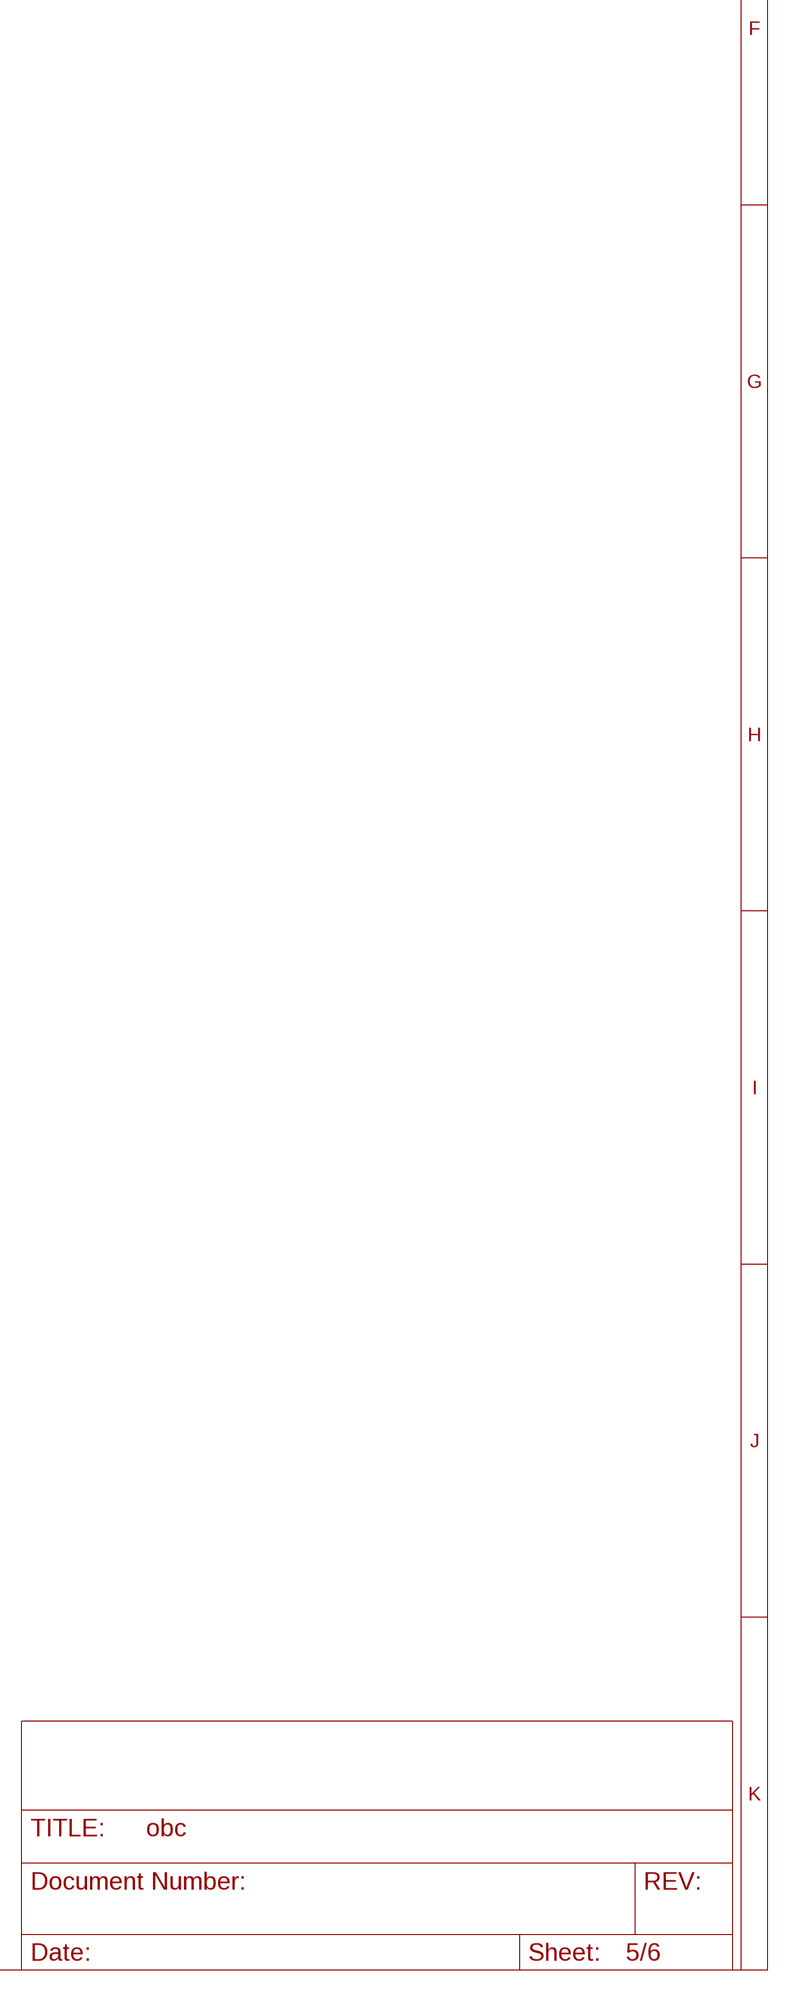
[diagram p13: schematic, sheet 5, part 3 of 3]

### Parts
R106  0 Ohm  R-EU_R0402  [R0402]
R107  0 Ohm  R-EU_R0402  [R0402]
R108  0 Ohm  R-EU_R0402  [R0402]
R109  0 Ohm  R-EU_R0402  [R0402]
R110  0 Ohm  R-EU_R0402  [R0402]
R111  0 Ohm  R-EU_R0402  [R0402]
R116  0 Ohm  R-EU_R0402  [R0402]
R117  0 Ohm  R-EU_R0402  [R0402]
R118  0 Ohm  R-EU_R0402  [R0402]
R119  0 Ohm  R-EU_R0402  [R0402]
R120  0 Ohm  R-EU_R0402  [R0402]
R121  0 Ohm  R-EU_R0402  [R0402]
R122  0 Ohm  R-EU_R0402  [R0402]
R123  0 Ohm  R-EU_R0402  [R0402]
R124  0 Ohm  R-EU_R0402  [R0402]
R125  0 Ohm  R-EU_R0402  [R0402]
R126  0 Ohm  R-EU_R0402  [R0402]
R127  0 Ohm  R-EU_R0402  [R0402]
R128  0 Ohm  R-EU_R0402  [R0402]
R129  0 Ohm  R-EU_R0402  [R0402]
R130  0 Ohm  R-EU_R0402  [R0402]
R131  0 Ohm  R-EU_R0402  [R0402]

### Nets
ADC0: R106.2
ADC1: R107.2
ADC2: R108.2
ADC3: R109.2
ADC4/SDA: R110.2
ADC5/SCL: R111.2
AIN0/PWM/OC0A: R122.2
AIN1/PWM: R123.2
CLKO/ICP1: R124.2
GPIO_AD_B0_00: R131.1 ; also sheet 1
GPIO_AD_B0_01: R130.1 ; also sheet 1
GPIO_AD_B0_02: R125.1 ; also sheet 1
GPIO_AD_B0_03: R124.1 ; also sheet 1
GPIO_AD_B0_09: R120.1 ; also sheet 1
GPIO_AD_B0_10: R121.1 ; also sheet 1
GPIO_AD_B0_11: R118.1 ; also sheet 1
GPIO_AD_B1_00: R111.1 ; also sheet 1
GPIO_AD_B1_01: R110.1 ; also sheet 1
GPIO_AD_B1_02: R122.1 ; also sheet 1
GPIO_AD_B1_03: R123.1 ; also sheet 1
GPIO_AD_B1_04: R108.1 ; also sheet 1
GPIO_AD_B1_05: R109.1 ; also sheet 1
GPIO_AD_B1_06: R117.1 ; also sheet 1
GPIO_AD_B1_07: R116.1 ; also sheet 1
GPIO_AD_B1_08: R119.1 ; also sheet 1
GPIO_AD_B1_10: R106.1 ; also sheet 1
GPIO_AD_B1_11: R107.1 ; also sheet 1
GPIO_SD_B0_00: R129.1 ; also sheet 1
GPIO_SD_B0_01: R126.1 ; also sheet 1
GPIO_SD_B0_02: R127.1 ; also sheet 1
GPIO_SD_B0_03: R128.1 ; also sheet 1
I2C_SCL: R131.2
I2C_SDA: R130.2
INT0: R118.2
INT1/PWM/OC2B: R119.2
OC1A/PWM: R125.2
OC2A/PWM/SPI_MOSI: R127.2
SPI_CLK: R129.2
SPI_CS: R126.2
SPI_MISO: R128.2
T0/XCK: R120.2
T1/PWM: R121.2
UART_RX: R116.2
UART_TX: R117.2

## Sheet 6 of 6: OpenSDA
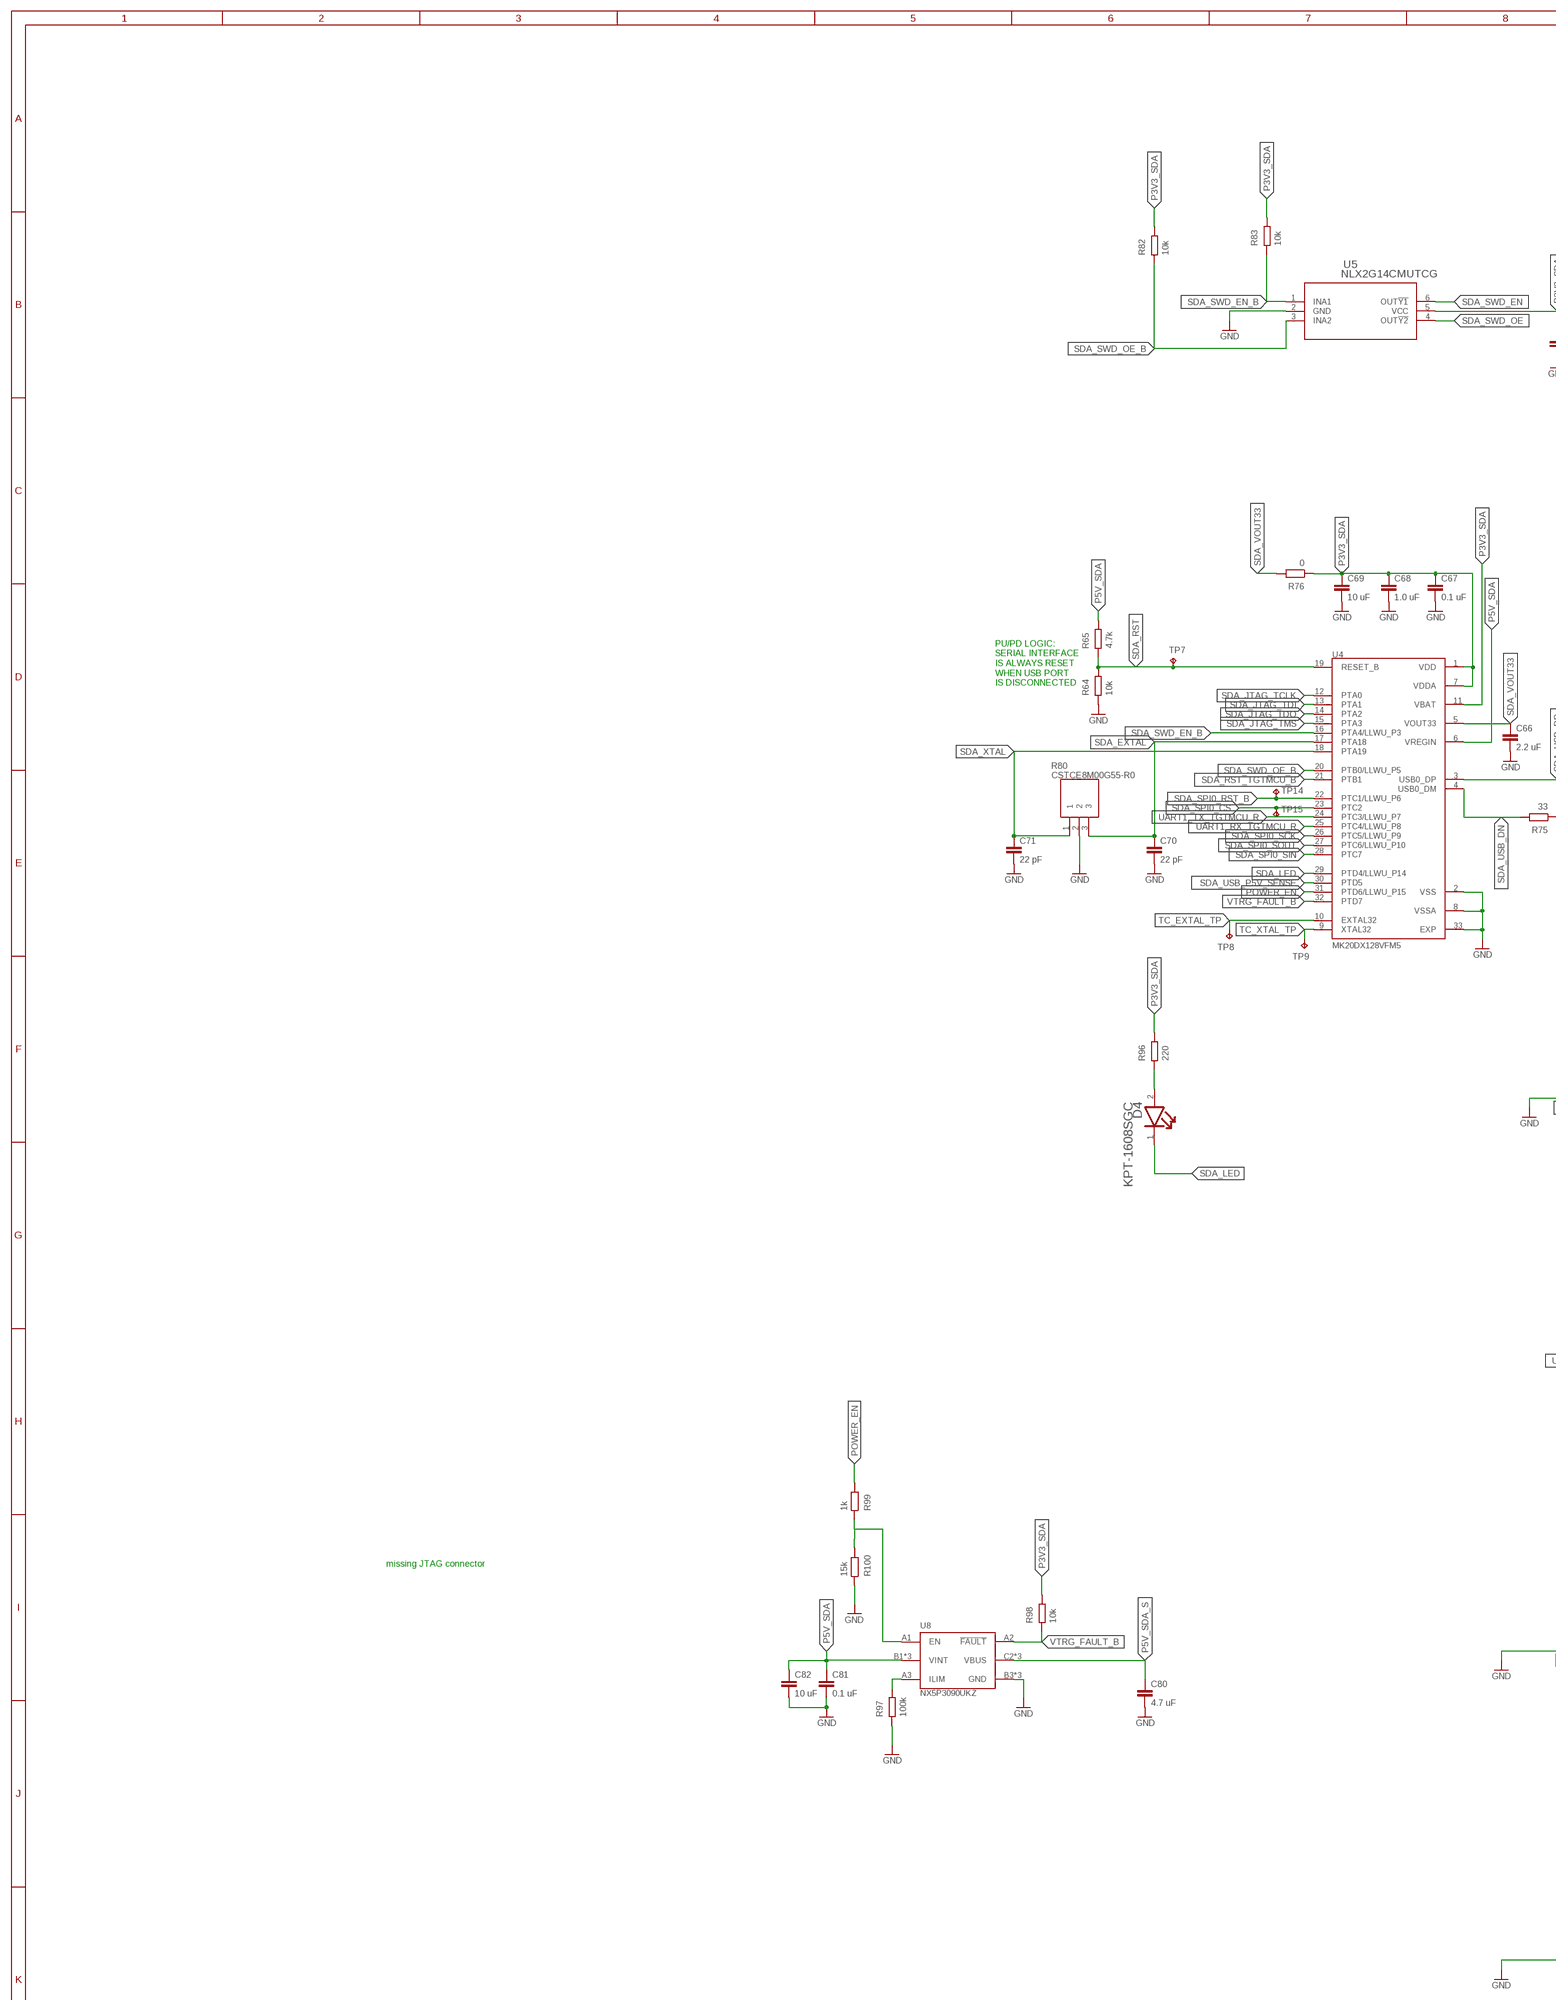
[diagram p14: schematic, sheet 6, part 1 of 3]
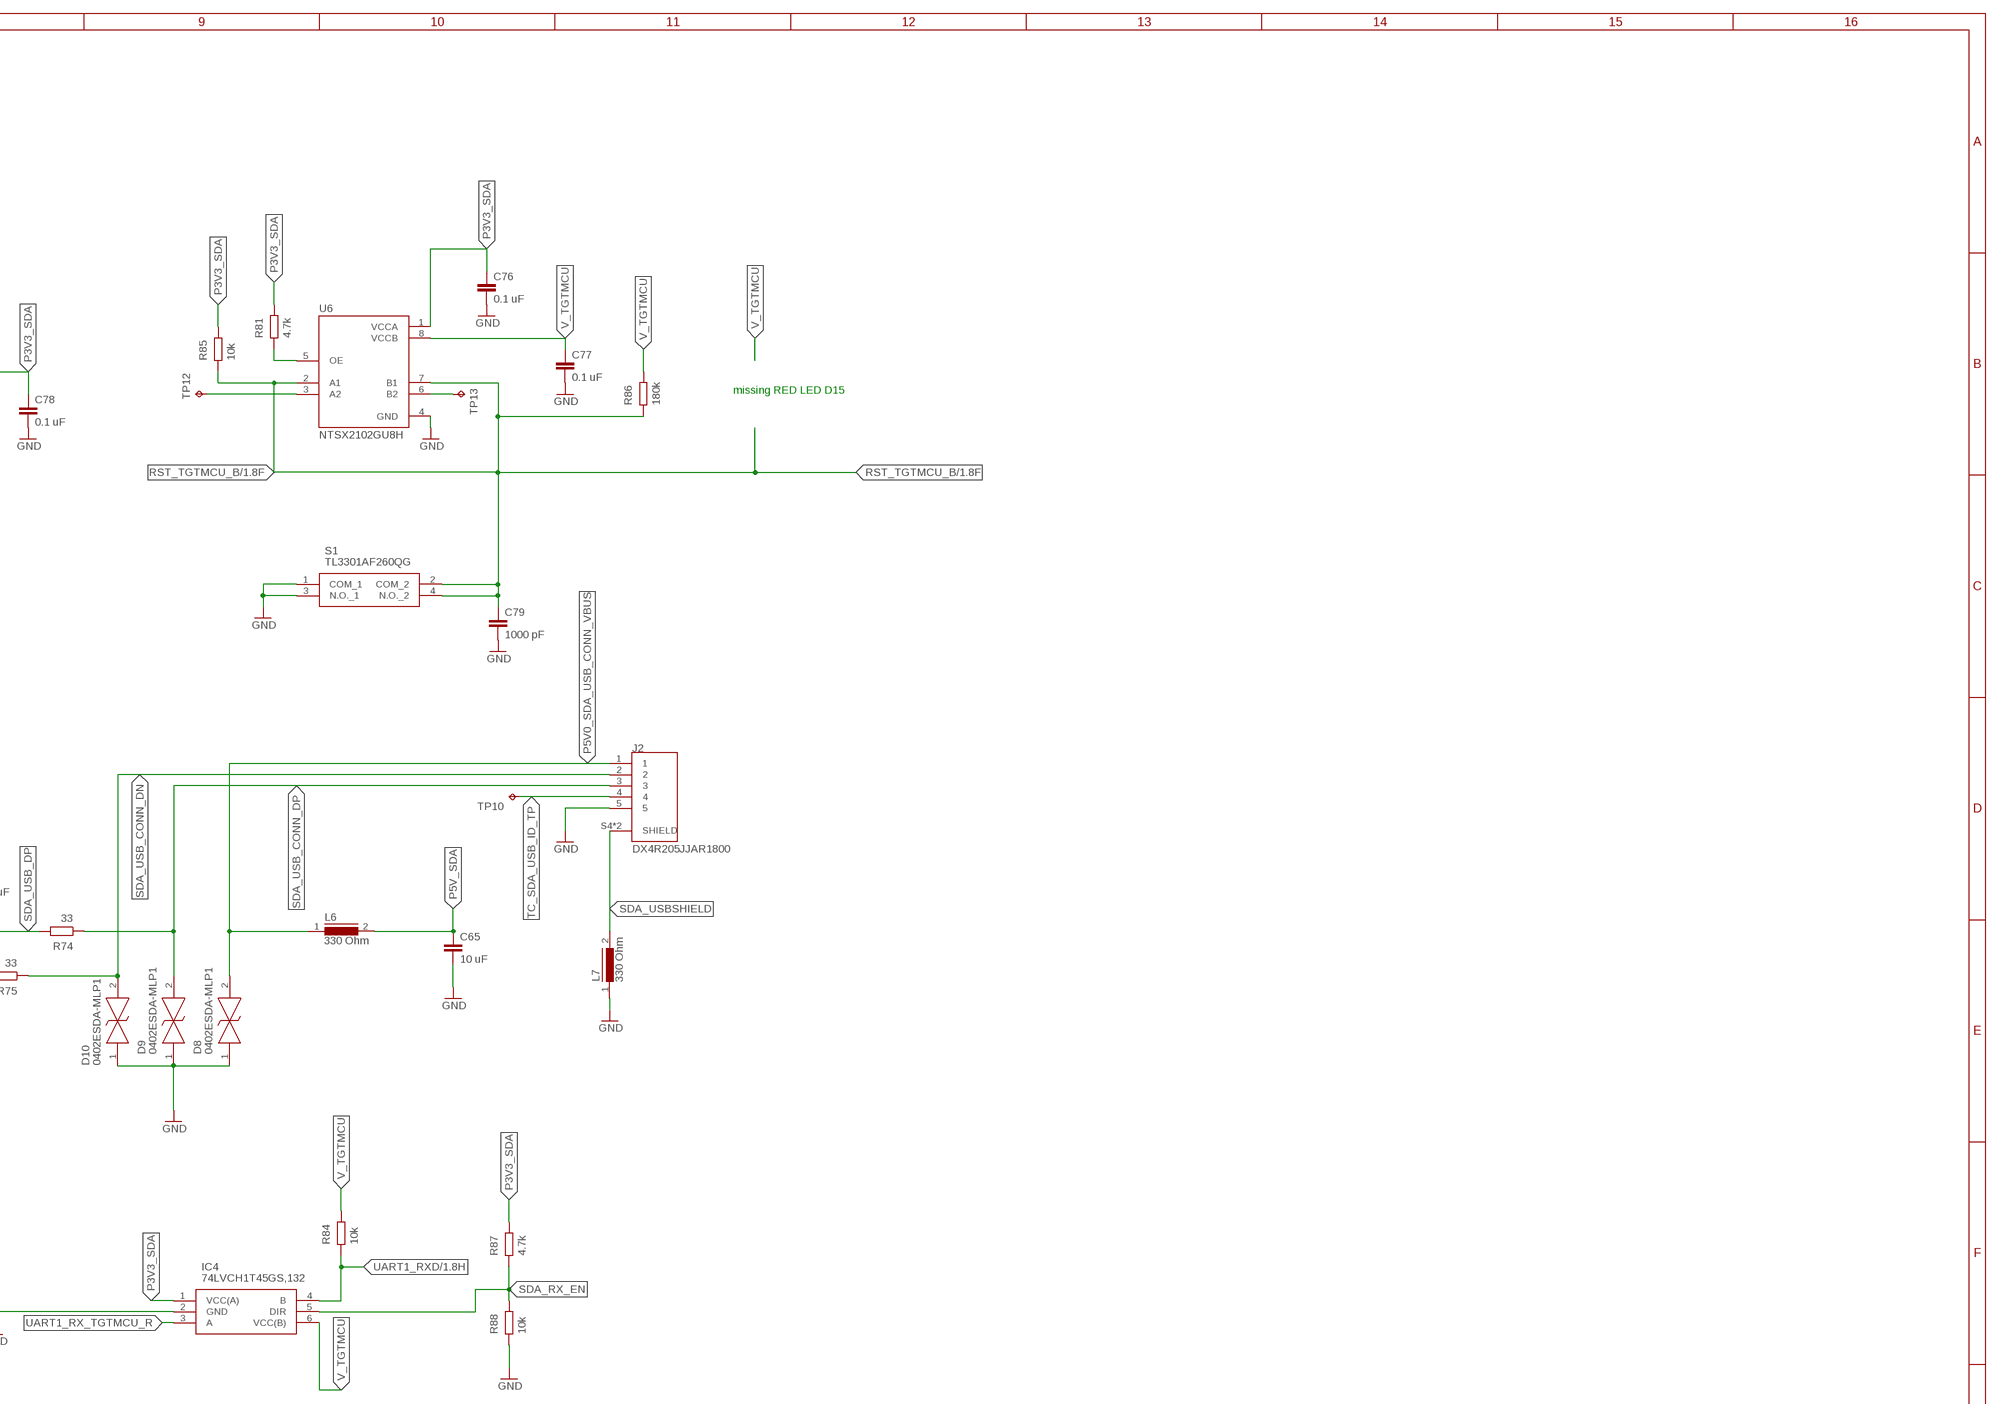
[diagram p15: schematic, sheet 6, part 2 of 3]
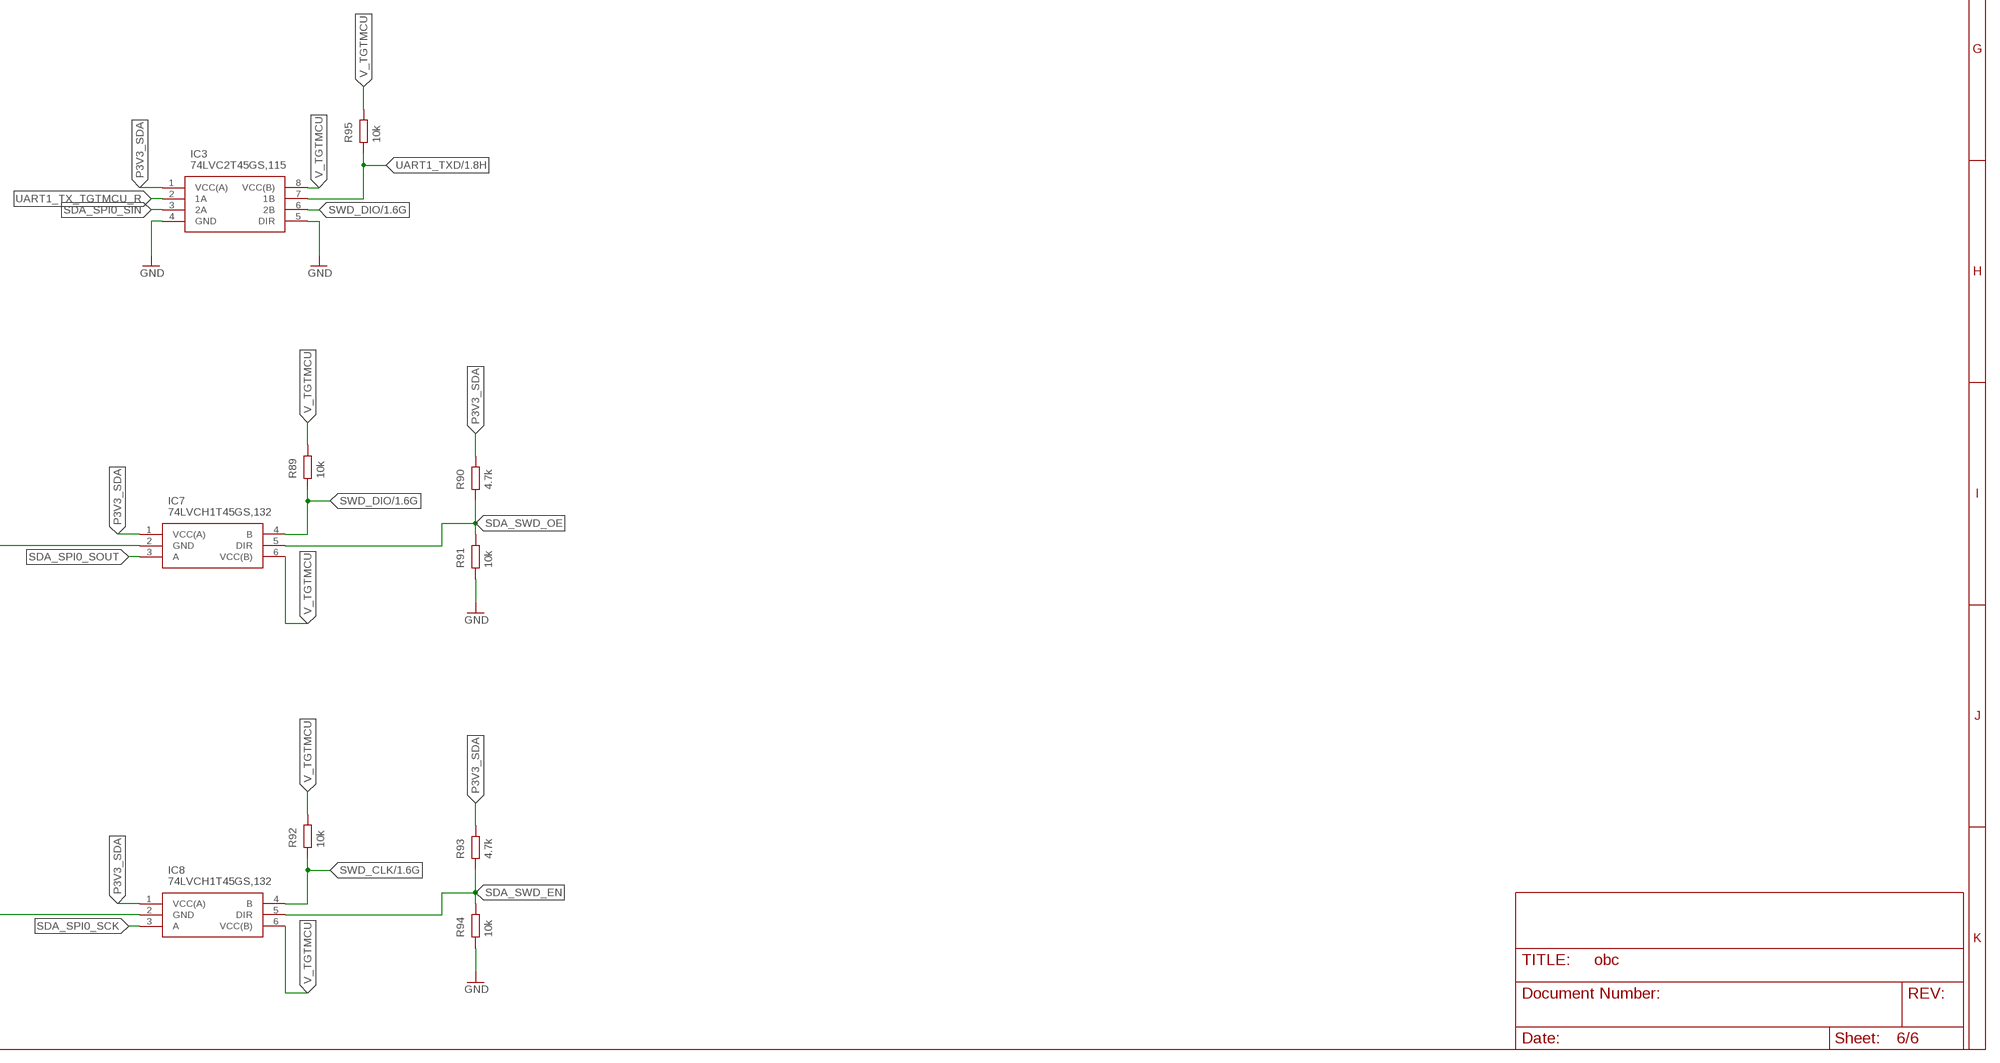
[diagram p16: schematic, sheet 6, part 3 of 3]

### Parts
C65  10 uF  C-EUC0402K  [C0402K]
C66  2.2 uF  C-EUC0402K  [C0402K]
C67  0.1 uF  C-EUC0402K  [C0402K]
C68  1.0 uF  C-EUC0402K  [C0402K]
C69  10 uF  C-EUC0402K  [C0402K]
C70  22 pF  C-EUC0402K  [C0402K]
C71  22 pF  C-EUC0402K  [C0402K]
C76  0.1 uF  C-EUC0402K  [C0402K]
C77  0.1 uF  C-EUC0402K  [C0402K]
C78  0.1 uF  C-EUC0402K  [C0402K]
C79  1000 pF  C-EUC0402K  [C0402K]
C80  4.7 uF  C-EUC0402K  [C0402K]
C81  0.1 uF  C-EUC0402K  [C0402K]
C82  10 uF  C-EUC0402K  [C0402K]
D4  KINGBRIGHT_KPT-1608SGCKINGBRIGHT_KPT-1608SGC_0_0  [KINGBRIGHT_KPT-1608SGC_0]
D8  0402ESDA-MLP1  [DIONC1105X44N]
D9  0402ESDA-MLP1  [DIONC1105X44N]
D10  0402ESDA-MLP1  [DIONC1105X44N]
IC3  74LVC2T45GS,115  [74AXP2T3407GSX]
IC4  74LVCH1T45GS,132  [74LVC1G3157GS132]
IC7  74LVCH1T45GS,132  [74LVC1G3157GS132]
IC8  74LVCH1T45GS,132  [74LVC1G3157GS132]
J2  DX4R205JJAR1800  [JAE_DX4R205JJAR1800]
L6  330 Ohm  B82132  [SUKW2-22]
L7  330 Ohm  B82132  [SUKW2-22]
R64  10k  R  (no package)
R65  4.7k  R  (no package)
R74  33  R  (no package)
R75  33  R  (no package)
R76  0  R  (no package)
R80  CSTCE8M00G55-R0  [CSTCE12M0G55-R0]
R81  4.7k  R  (no package)
R82  10k  R  (no package)
R83  10k  R  (no package)
R84  10k  R  (no package)
R85  10k  R  (no package)
R86  180k  R  (no package)
R87  4.7k  R  (no package)
R88  10k  R  (no package)
R89  10k  R  (no package)
R90  4.7k  R  (no package)
R91  10k  R  (no package)
R92  10k  R  (no package)
R93  4.7k  R  (no package)
R94  10k  R  (no package)
R95  10k  R  (no package)
R96  220  R  (no package)
R97  100k  R  (no package)
R98  10k  R  (no package)
R99  1k  R  (no package)
R100  15k  R  (no package)
S1  TL3301AF260QG  [TL3301AF260QG]
TP7  TPTP06R  [TP06R]
TP8  TPTP06R  [TP06R]
TP9  TPTP06R  [TP06R]
TP10  TPTP06R  [TP06R]
TP12  TPTP06R  [TP06R]
TP13  TPTP06R  [TP06R]
TP14  TPTP06R  [TP06R]
TP15  TPTP06R  [TP06R]
U4  MK20DX128VFM5  [QFN50P500X500X100-33N]
U5  NLX2G14CMUTCG  [UDFN6_1X1]
U6  NTSX2102GU8H  [QFN40P140X120X50-8N]
U8  NX5P3090UKZ  [BGA12CP40_3X4_135X165X56B26N]

### Nets
AAA: R99.1 R100.2 U8.A1(EN)
GND: C65.2 C66.2 C67.2 C68.2 C69.2 C70.2 C71.2 C76.2 C77.2 C78.2 C79.2 C80.2 C81.2 C82.2 D8.1 D9.1 D10.1 IC3.4(GND) IC3.5(DIR) IC4.2(GND) IC7.2(GND) IC8.2(GND) J2.5 L7.1 R64.1 R80.2 R88.1 R91.1 R94.1 R97.1 R100.1 S1.1(COM_1) S1.3(N.O._1) U4.2(VSS) U4.8(VSSA) U4.33(EXP) U5.2(GND) U6.4(GND) U8.B3(GND) U8.C3(GND) U8.D3(GND) ; also sheet 1,2,3,4
N$54: R81.1 U6.5(OE)
N$57: TP12.TP U6.3(A2)
N$58: D4.2(ANODE) R96.1
N$59: R97.2 U8.A3(ILIM)
N$60: TP13.TP U6.6(B2)
P3V3_SDA: C67.1 C68.1 C69.1 C76.1 C78.1 IC3.1(VCC(A)) IC4.1(VCC(A)) IC7.1(VCC(A)) IC8.1(VCC(A)) R76.1 R81.2 R82.2 R83.2 R85.2 R87.2 R90.2 R93.2 R96.2 R98.2 U4.1(VDD) U4.7(VDDA) U4.11(VBAT) U5.5(VCC) U6.1(VCCA)
P5V0_SDA_USB_CONN_VBUS: D8.2 J2.1 L6.1
P5V_SDA: C65.1 C81.1 C82.1 L6.2 R65.2 U4.6(VREGIN) U8.B1(VINT) U8.B2(VINT) U8.C1(VINT)
P5V_SDA_S: C80.1 U8.C2(VBUS) U8.D1(VBUS) U8.D2(VBUS)
POWER_EN: R99.2 U4.31(PTD6/LLWU_P15)
RST_TGTMCU_B: C79.1 R85.1 R86.1 S1.2(COM_2) S1.4(N.O._2) U6.2(A1) U6.7(B1) ; also sheet 1
SDA_EXTAL: C70.1 R80.3 U4.17(PTA18)
SDA_JTAG_TCLK: U4.12(PTA0)
SDA_JTAG_TDI: U4.13(PTA1)
SDA_JTAG_TDO: U4.14(PTA2)
SDA_JTAG_TMS: U4.15(PTA3)
SDA_LED: D4.1(CATHODE) U4.29(PTD4/LLWU_P14)
SDA_RST: R64.2 R65.1 TP7.TP U4.19(RESET_B)
SDA_RST_TGTMCU_B: U4.21(PTB1)
SDA_RX_EN: IC4.5(DIR) R87.1 R88.2
SDA_SPI0_CS: TP15.TP U4.23(PTC2)
SDA_SPI0_RST_B: TP14.TP U4.22(PTC1/LLWU_P6)
SDA_SPI0_SCK: IC8.3(A) U4.26(PTC5/LLWU_P9)
SDA_SPI0_SIN: IC3.3(2A) U4.28(PTC7)
SDA_SPI0_SOUT: IC7.3(A) U4.27(PTC6/LLWU_P10)
SDA_SWD_EN: IC8.5(DIR) R93.1 R94.2 U5.6(OUT!Y1)
SDA_SWD_EN_B: R83.1 U4.16(PTA4/LLWU_P3) U5.1(INA1)
SDA_SWD_OE: IC7.5(DIR) R90.1 R91.2 U5.4(OUT!Y2)
SDA_SWD_OE_B: R82.1 U4.20(PTB0/LLWU_P5) U5.3(INA2)
SDA_USB_CONN_DN: D10.2 J2.2 R75.1
SDA_USB_CONN_DP: D9.2 J2.3 R74.1
SDA_USB_DN: R75.2 U4.4(USB0_DM)
SDA_USB_DP: R74.2 U4.3(USB0_DP)
SDA_USB_P5V_SENSE: U4.30(PTD5)
SDA_USBSHIELD: J2.S4(SHIELD) J2.S5(SHIELD) L7.2
SDA_VOUT33: C66.1 R76.2 U4.5(VOUT33)
SDA_XTAL: C71.1 R80.1 U4.18(PTA19)
SWD_CLK: IC8.4(B) R92.1 ; also sheet 1
SWD_DIO: IC3.6(2B) IC7.4(B) R89.1 ; also sheet 1
TC_EXTAL_TP: TP8.TP U4.10(EXTAL32)
TC_SDA_USB_ID_TP: J2.4 TP10.TP
TC_XTAL_TP: TP9.TP U4.9(XTAL32)
UART1_RX_TGTMCU_R: IC4.3(A) U4.25(PTC4/LLWU_P8)
UART1_RXD: IC4.4(B) R84.1 ; also sheet 1
UART1_TX_TGTMCU_R: IC3.2(1A) U4.24(PTC3/LLWU_P7)
UART1_TXD: IC3.7(1B) R95.1 ; also sheet 1
V_TGTMCU: C77.1 IC3.8(VCC(B)) IC4.6(VCC(B)) IC7.6(VCC(B)) IC8.6(VCC(B)) R84.2 R86.2 R89.2 R92.2 R95.2 U6.8(VCCB)
VTRG_FAULT_B: R98.1 U4.32(PTD7) U8.A2(!FAULT)

### Notes on the sheet
- missing RED LED D15
- PU/PD LOGIC:
  SERIAL INTERFACE
  IS ALWAYS RESET 
  WHEN USB PORT 
  IS DISCONNECTED
- missing JTAG connector

## Power pins joined to a net without a drawn wire
NVCC_SD0: U1.J6(NVCC_SD0)

## Library data of the parts
C1-C37 C39-C48 C51-C56 C63-C71 C76-C97 = rcl:C-EU: CAPACITOR, European symbol; SPICEPREFIX: C
D1-D3 = diode:SCHOTTKY-DIODE: Schottky Diode
D4 D5 D11 = Kingbright - KPT-1608SGC:KINGBRIGHT_KPT-1608SGC: LED, Low Power, Green, SMD, 20 mA, 2.2 V, 568 nm; CENTROID_NOT_SPECIFIED: No; COLOUR: Green; DATASHEET: http://www.kingbright.com/attachments/file/psearch/000/00/00/KPT-1608SGC(Ver.29B).pdf; DEVICE_CLASS_L1: Optoelectronics; DEVICE_CLASS_L2: LEDs; DEVICE_CLASS_L3: unset; FORWARD_CURRENT: 25mA; FORWARD_VOLTAGE: 2.2V; HEIGHT: 0.85mm; LEAD_FREE: yes; LED_ORIENTATION: Top View; LUMINOUS_INTENSITY: 12mcd; MAX_JUNCTION_TEMP: +110°C; MF: Kingbright; MFG_PACKAGE_IDENT: KPT-1608SGC; MFG_PACKAGE_IDENT_DATE: 0; MFG_PACKAGE_IDENT_REV: 0; MPN: KPT-1608SGC; PACKAGE: 0603; POWER_DISSIPATION: 62.5mW; PREFIX: D; REVERSE_VOLTAGE: 5V; ROHS: yes; TEMPERATURE_RANGE_HIGH: +85°C; TEMPERATURE_RANGE_LOW: -40°C; VERIFICATION_VERSION: 0.0.0.1; VIEWING_ANGLE: 150°; WAVELENGTH: 568nm
D6 D7 = diode:BAT60J: Schottky barrier diode Source: www.st.com, BAT60J.pdf
D8-D10 = 0402ESDA-MLP1:0402ESDA-MLP1: ESD Suppressors / TVS Diodes PolySurg 0402 35V .05pF Source: Datasheet <https://componentsearchengine.com/Datasheets/1/0402ESDA-MLP1.pdf>; DESCRIPTION: ESD Suppressors / TVS Diodes PolySurg 0402 35V .05pF; HEIGHT: 0.436mm; MANUFACTURER_NAME: Eaton; MANUFACTURER_PART_NUMBER: 0402ESDA-MLP1; MOUSER_PART_NUMBER: 504-0402ESDA-MLP1; MOUSER_PRICE-STOCK: https://www.mouser.com/Search/Refine.aspx?Keyword=504-0402ESDA-MLP1
IC1 = SDRAM_and_HyperFlash:IS42S16160J-6BLI: DRAM 256M, 3.3V, SDRAM, 16Mx16, 166Mhz, 54 ball BGA (8mmx8mm) RoHS, IT Source: Datasheet <https://componentsearchengine.com/Datasheets/1/IS42S16160J-6BLI.pdf>; DESCRIPTION: DRAM 256M, 3.3V, SDRAM, 16Mx16, 166Mhz, 54 ball BGA (8mmx8mm) RoHS, IT; HEIGHT: 1.2mm; MANUFACTURER_NAME: Integrated Silicon Solution Inc.; MANUFACTURER_PART_NUMBER: IS42S16160J-6BLI; MOUSER_PART_NUMBER: 870-42S16160J6BLI; MOUSER_PRICE-STOCK: https://www.mouser.com/Search/Refine.aspx?Keyword=870-42S16160J6BLI
IC2 = SDRAM_and_HyperFlash:S26KS512SDPBHI020: 1.8V 512MBIT, HYPERFLASH, 166M Source: Datasheet <https://componentsearchengine.com/Datasheets/1/S26KS512SDPBHI020.pdf>; DESCRIPTION: 1.8V 512MBIT, HYPERFLASH, 166M; HEIGHT: 1mm; MANUFACTURER_NAME: Cypress Semiconductor; MANUFACTURER_PART_NUMBER: S26KS512SDPBHI020; MOUSER_PART_NUMBER: 727-26KS512SDPBHI020; MOUSER_PRICE-STOCK: https://www.mouser.com/Search/Refine.aspx?Keyword=727-26KS512SDPBHI020
IC3 = 74LVC2T45GS_115:74LVC2T45GS,115: 74LVC2T45; 74LVCH2T45 - Dual supply translating transceiver; 3-state@en-us Source: Datasheet <https://componentsearchengine.com/Datasheets/1/74LVC2T45GS,115.pdf>; DESCRIPTION: 74LVC2T45; 74LVCH2T45 - Dual supply translating transceiver; 3-state@en-us; HEIGHT: 0.35mm; MANUFACTURER_NAME: Nexperia; MANUFACTURER_PART_NUMBER: 74LVC2T45GS,115; MOUSER_PART_NUMBER: 771-74LVC2T45GS115; MOUSER_PRICE-STOCK: https://www.mouser.com/Search/Refine.aspx?Keyword=771-74LVC2T45GS115
IC4 IC7 IC8 = 74LVCH1T45GS_132:74LVCH1T45GS,132: 74LVC1T45; 74LVCH1T45 - Dual supply translating transceiver; 3-state@en-us Source: Datasheet <https://componentsearchengine.com/Datasheets/1/74LVCH1T45GS,132.pdf>; DESCRIPTION: 74LVC1T45; 74LVCH1T45 - Dual supply translating transceiver; 3-state@en-us; HEIGHT: 0.35mm; MANUFACTURER_NAME: Nexperia; MANUFACTURER_PART_NUMBER: 74LVCH1T45GS,132; MOUSER_PART_NUMBER: 771-74LVCH1T45GS132; MOUSER_PRICE-STOCK: https://www.mouser.com/Search/Refine.aspx?Keyword=771-74LVCH1T45GS132
IC5 = MP2144GJ-Z:MP2144GJ-Z: Switching Voltage Regulators 2A, 5.5V, 1.2MHz Sync Stp-Dwn Swtchr Source: Datasheet <https://componentsearchengine.com/Datasheets/1/MP2144GJ-Z.pdf>; DESCRIPTION: Switching Voltage Regulators 2A, 5.5V, 1.2MHz Sync Stp-Dwn Swtchr; HEIGHT: 1mm; MANUFACTURER_NAME: Monolithic Power Systems (MPS); MANUFACTURER_PART_NUMBER: MP2144GJ-Z; MOUSER_PART_NUMBER: 946-MP2144GJZ; MOUSER_PRICE-STOCK: https://www.mouser.com/Search/Refine.aspx?Keyword=946-MP2144GJZ
J2 = DX4R205JJAR1800:DX4R205JJAR1800: CONN RCPT MICRO USB 2.0 AB; DESCRIPTION: DX4 series, receptacle, on-board, right-angle standard mount, surface mount; DIGI-KEY_PART_NUMBER: 670-2677-1-ND; DIGI-KEY_PURCHASE_URL: https://www.digikey.com/product-detail/en/jae-electronics/DX4R205JJAR1800/670-2677-1-ND/3903237?utm_source=snapeda&utm_medium=aggregator&utm_campaign=symbol; MF: JAE Electronics; MP: DX4R205JJAR1800; PACKAGE: None
JP1 = pinhead:PINHD-2X10: PIN HEADER
L1 = inductors:BLM15H: EMIFIL (R) Chip Ferrite Bead for GHz Noise Source: http://www.murata.com/ Ferrite Bead BLM15H.pdf
L2 L9 = rcl:L-EU: INDUCTOR, European symbol; SPICEPREFIX: L
L6 L7 = inductors:B82132: INDUCTOR; SPICEPREFIX: L
Q1 = crystal:FA-: MHz RANGE CRYSTAL UNIT Source: Epson Toyocom
Q3 = crystal:FC-12M: kHz RANGE CRYSTAL UNIT LOW PROFILE SMD Source: Epson Toyocom FC-12M.pdf
R1-R8 R12-R18 R20-R27 R36-R40 R43 R44 R46-R48 R50 R55-R59 R63 R101-R134 = rcl:R-EU_: RESISTOR, European symbol; SPICEPREFIX: R
R64 R65 R74-R76 R81-R100 = ngspice-simulation:R: RESISTOR
R80 = CSTCE8M00G55-R0:CSTCE8M00G55-R0: SMT ceramic resonator 8.0MHz CSTCE8M00G55-R0, Ceramic Resonator, 8MHz Fundamental 33pF, 3-Pin Cap Chip, 3.2 x 1.3 x 0.7mm Source: Datasheet <https://componentsearchengine.com/Datasheets/1/CSTCE8M00G55-R0.pdf>; DESCRIPTION: SMT ceramic resonator 8.0MHz CSTCE8M00G55-R0, Ceramic Resonator, 8MHz Fundamental 33pF, 3-Pin Cap Chip, 3.2 x 1.3 x 0.7mm; HEIGHT: mm; MANUFACTURER_NAME: Murata Electronics; MANUFACTURER_PART_NUMBER: CSTCE8M00G55-R0; MOUSER_PART_NUMBER: 81-CSTCE8M00G55-R0; MOUSER_PRICE-STOCK: https://www.mouser.com/Search/Refine.aspx?Keyword=81-CSTCE8M00G55-R0
S1 = TL3301AF260QG:TL3301AF260QG: E-SWITCH - TL3301AF260QG - SWITCH, TACTILE SPST 50mA, SMD GULL WING Source: Datasheet <https://componentsearchengine.com/Datasheets/1/TL3301AF260QG.pdf>; DESCRIPTION: E-SWITCH - TL3301AF260QG - SWITCH, TACTILE SPST 50mA, SMD GULL WING; HEIGHT: 7mm; MANUFACTURER_NAME: E-Switch; MANUFACTURER_PART_NUMBER: TL3301AF260QG; MOUSER_PART_NUMBER: 612-TL3301AF2; MOUSER_PRICE-STOCK: https://www.mouser.com/Search/Refine.aspx?Keyword=612-TL3301AF2
TP1 TP4 TP6-TP10 TP12-TP16 = testpad:TP: Test pad
U1 = MIMXRT1052DVL6A:MIMXRT1052DVL6A: MIMXRT1052: 3.3 V 600 MHz ARM® Cortex®-M7 Microprocessor IC; DESCRIPTION: MIMXRT1052: 3.3 V 600 MHz ARM® Cortex®-M7 Microprocessor IC; DIGI-KEY_PART_NUMBER: 568-13515-ND; DIGI-KEY_PURCHASE_URL: https://www.digikey.com/product-detail/en/nxp-usa-inc/MIMXRT1052DVL6A/568-13515-ND/7646297?utm_source=snapeda&utm_medium=aggregator&utm_campaign=symbol; MF: NXP USA; MP: MIMXRT1052DVL6A; PACKAGE: LFBGA-196 NXP Semiconductors
U4 = MK20DX128VFM5:MK20DX128VFM5: Kinetis K20: 50MHz Cortex-M4 Performance MCU, 160KB Flash, 16KB SRAM, Full-Speed USB, 32-QFN; DESCRIPTION: MCU 32-bit Kinetis K20 ARM Cortex M4 RISC 128KB Flash 1.8V/2.5V/3.3V 32-Pin QFN EP Tray; DIGI-KEY_PART_NUMBER: MK20DX128VFM5-ND; DIGI-KEY_PURCHASE_URL: https://www.digikey.com/product-detail/en/nxp-usa-inc/MK20DX128VFM5/MK20DX128VFM5-ND/3507507?utm_source=snapeda&utm_medium=aggregator&utm_campaign=symbol; MF: MikroElektronika; MP: MK20DX128VFM5; PACKAGE: QFN-32 Freescale Semiconductor
U5 = NLX2G14CMUTCG:NLX2G14CMUTCG; BUILT_BY: EMA_Jessica; COPYRIGHT: Copyright (C) 2016 Accelerated Designs. All rights reserved; MANUFACTURER_PART_NUMBER: NLX2G14CMUTCG; VENDOR: ON Semiconductor
U6 = NTSX2102GU8H:NTSX2102GU8H: NTSX2102 - Dual supply translating transceiver; open drain; auto direction sensing; DESCRIPTION: NTSX2102 - Dual supply translating transceiver; open drain; auto direction sensing; DIGI-KEY_PART_NUMBER: 568-10216-1-ND; DIGI-KEY_PURCHASE_URL: https://www.digikey.com/product-detail/en/nxp-usa-inc/NTSX2102GU8H/568-10216-1-ND/3991872?utm_source=snapeda&utm_medium=aggregator&utm_campaign=symbol; MF: NXP USA; MP: NTSX2102GU8H; PACKAGE: XQFN-8 NXP Semiconductors
U8 = NX5P3090UKZ:NX5P3090UKZ: USB Power SW Single 2.5V to 5.5V 0.4A to 3.3A 12-Pin WLCSP; DESCRIPTION: USB Power SW Single 2.5V to 5.5V 0.4A to 3.3A 12-Pin WLCSP; DIGI-KEY_PART_NUMBER: 568-13049-1-ND; DIGI-KEY_PURCHASE_URL: https://www.digikey.com/product-detail/en/nxp-usa-inc/NX5P3090UKZ/568-13049-1-ND/6173637?utm_source=snapeda&utm_medium=aggregator&utm_campaign=symbol; MF: NXP USA; MP: NX5P3090UKZ; PACKAGE: UFBGA-12 NXP Semiconductors
U9 = TC1270ASVRCTR:TC1270ASVRCTR; BUILT_BY: EMA_Jessica; COPYRIGHT: Copyright (C) 2018 Accelerated Designs. All rights reserved; MANUFACTURER_PART_NUMBER: TC1270ASVRCTR; VENDOR: Microchip